# EAGLE design WiFiMp3 (EAGLE 5.10)

## Sheet 1 of 11
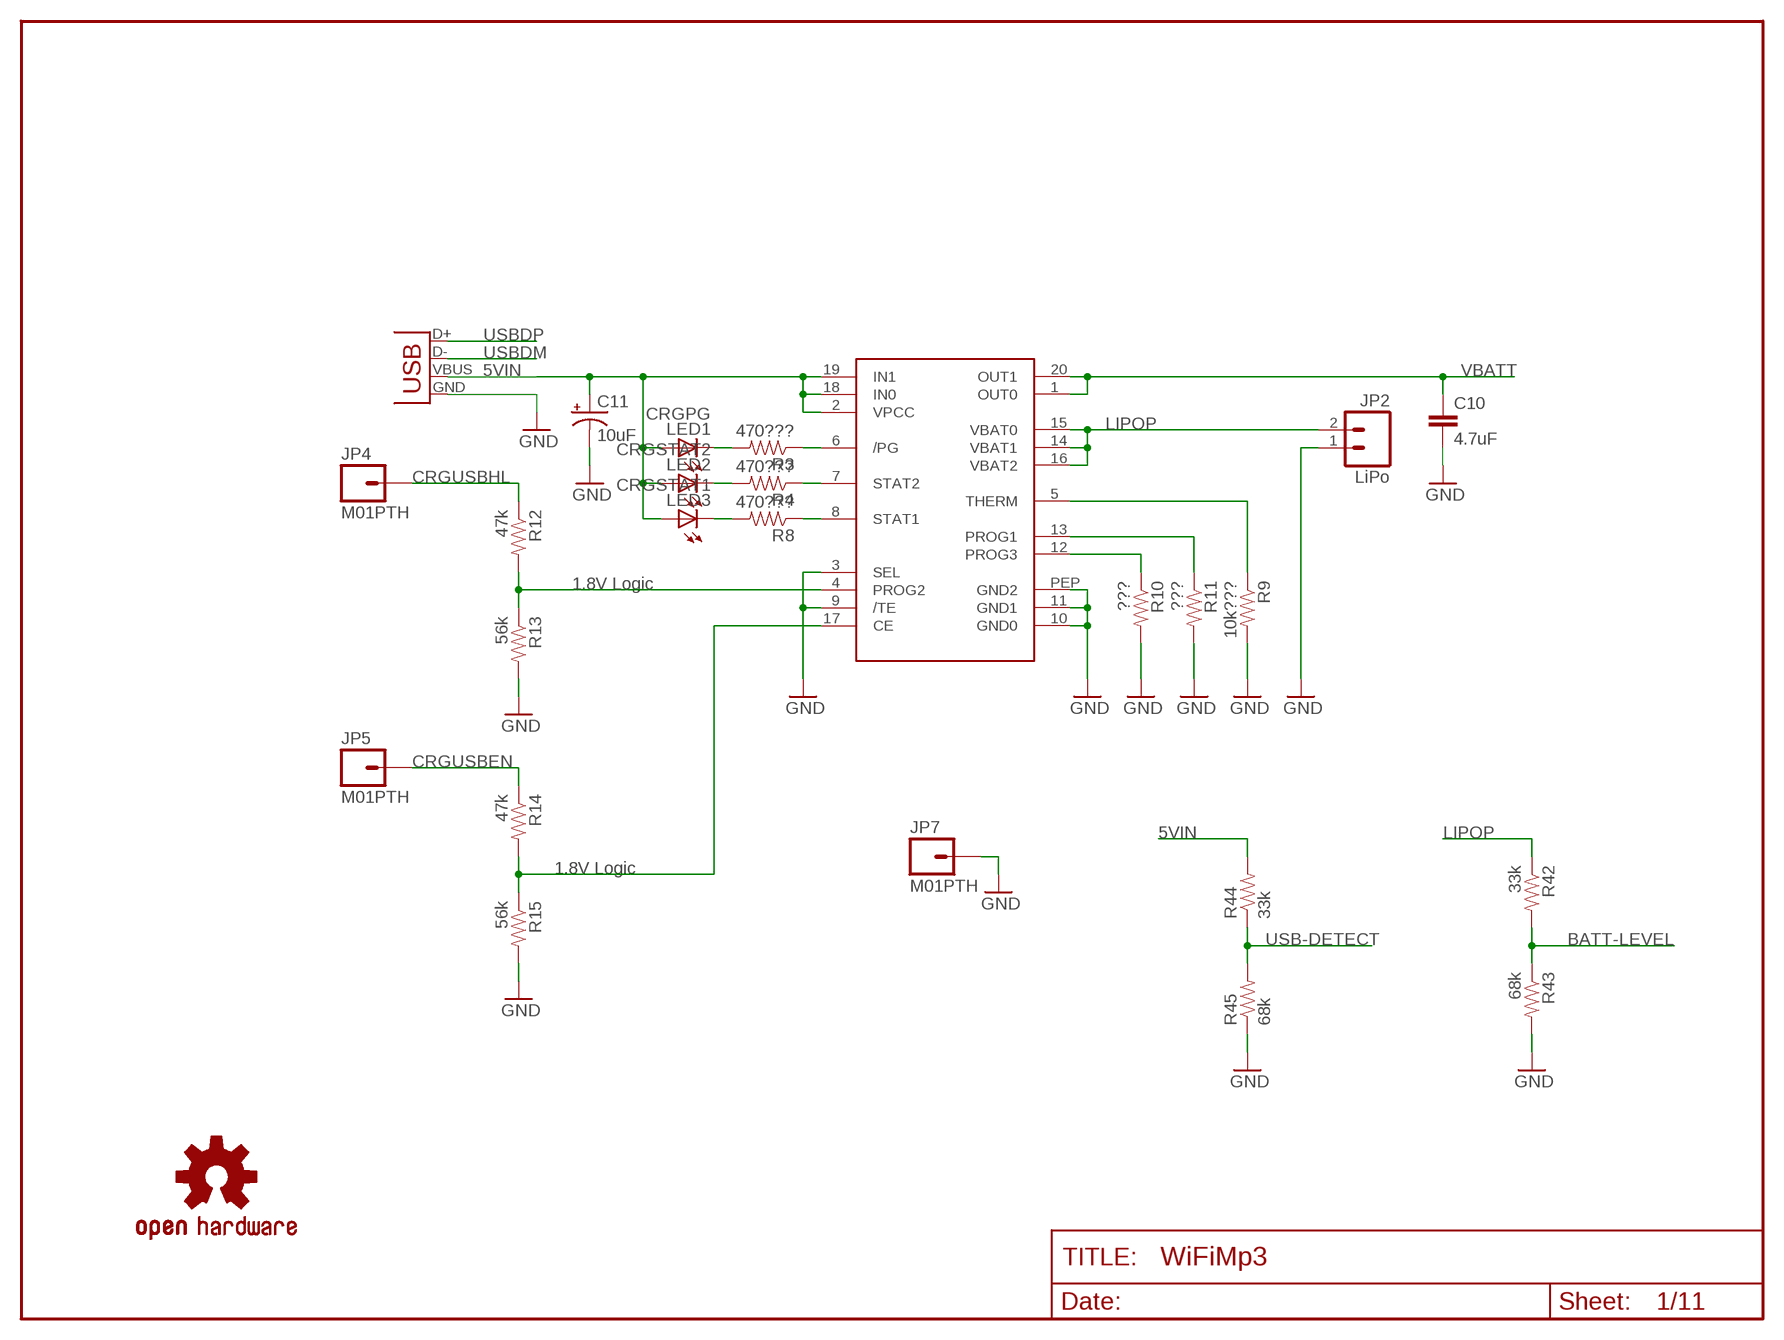
[diagram p0: schematic, sheet 1]

### Parts
C10  4.7uF  CAP0805  [0805]
C11  10uF  CAP_POL1206  [EIA3216]
JP2  LiPo  M02-JST-2MM-SMT  [JST-2-SMD]
JP4  M01PTH  [1X01]
JP5  M01PTH  [1X01]
JP7  M01PTH  [1X01]
LED1  CRGPG  LED1206  [LED-1206]
LED2  CRGSTAT2  LED1206  [LED-1206]
LED3  CRGSTAT1  LED1206  [LED-1206]
R3  470???  RESISTOR0805-RES  [0805]
R4  470???  RESISTOR0805-RES  [0805]
R8  470???  RESISTOR0805-RES  [0805]
R9  10k???  RESISTOR0805-RES  [0805]
R10  ???  RESISTOR0805-RES  [0805]
R11  ???  RESISTOR0805-RES  [0805]
R12  47k  RESISTOR0805-RES  [0805]
R13  56k  RESISTOR0805-RES  [0805]
R14  47k  RESISTOR0805-RES  [0805]
R15  56k  RESISTOR0805-RES  [0805]
R42  33k  RESISTOR0805-RES  [0805]
R43  68k  RESISTOR0805-RES  [0805]
R44  33k  RESISTOR0805-RES  [0805]
R45  68k  RESISTOR0805-RES  [0805]
U1  MCP73871  [QFN-20]
U$4  OSHW-LOGOM  [OSHW-LOGO-M]
X1  USB-MICROB  [USB-MICROB]

### Nets
5VIN: C11.A(+) LED1.A LED2.A LED3.A R44.2 U1.2(VPCC) U1.18(IN0) U1.19(IN1) X1.VBUS ; also sheet 10
BATT-LEVEL: R42.2 R43.1 ; also sheet 5
CRGUSBEN: JP5.1 R14.1 ; also sheet 5
CRGUSBHL: JP4.1 R12.1 ; also sheet 5
GND: C10.2 C11.C(-) JP2.1 JP7.1 R9.2 R10.2 R11.2 R13.2 R15.2 R43.2 R45.1 U1.3(SEL) U1.9(/TE) U1.10(GND0) U1.11(GND1) U1.PEP(GND2) X1.GND ; also sheet 2,3,4,5,6,7,8,9,10,11
LIPOP: JP2.2 R42.1 U1.14(VBAT1) U1.15(VBAT0) U1.16(VBAT2)
N$10: R3.1 U1.6(/PG)
N$11: R4.1 U1.7(STAT2)
N$12: R8.1 U1.8(STAT1)
N$13: LED3.C R8.2
N$14: LED2.C R4.2
N$15: LED1.C R3.2
N$16: R9.1 U1.5(THERM)
N$17: R12.2 R13.1 U1.4(PROG2)
N$18: R10.1 U1.12(PROG3)
N$19: R11.1 U1.13(PROG1)
N$21: R14.2 R15.1 U1.17(CE)
USB-DETECT: R44.1 R45.2 ; also sheet 5
USBDM: X1.D- ; also sheet 5,10
USBDP: X1.D+ ; also sheet 5,10
VBATT: C10.1 U1.1(OUT0) U1.20(OUT1) ; also sheet 2,3,4,5

### Notes on the sheet
- 1.8V Logic
- 1.8V Logic

## Sheet 2 of 11
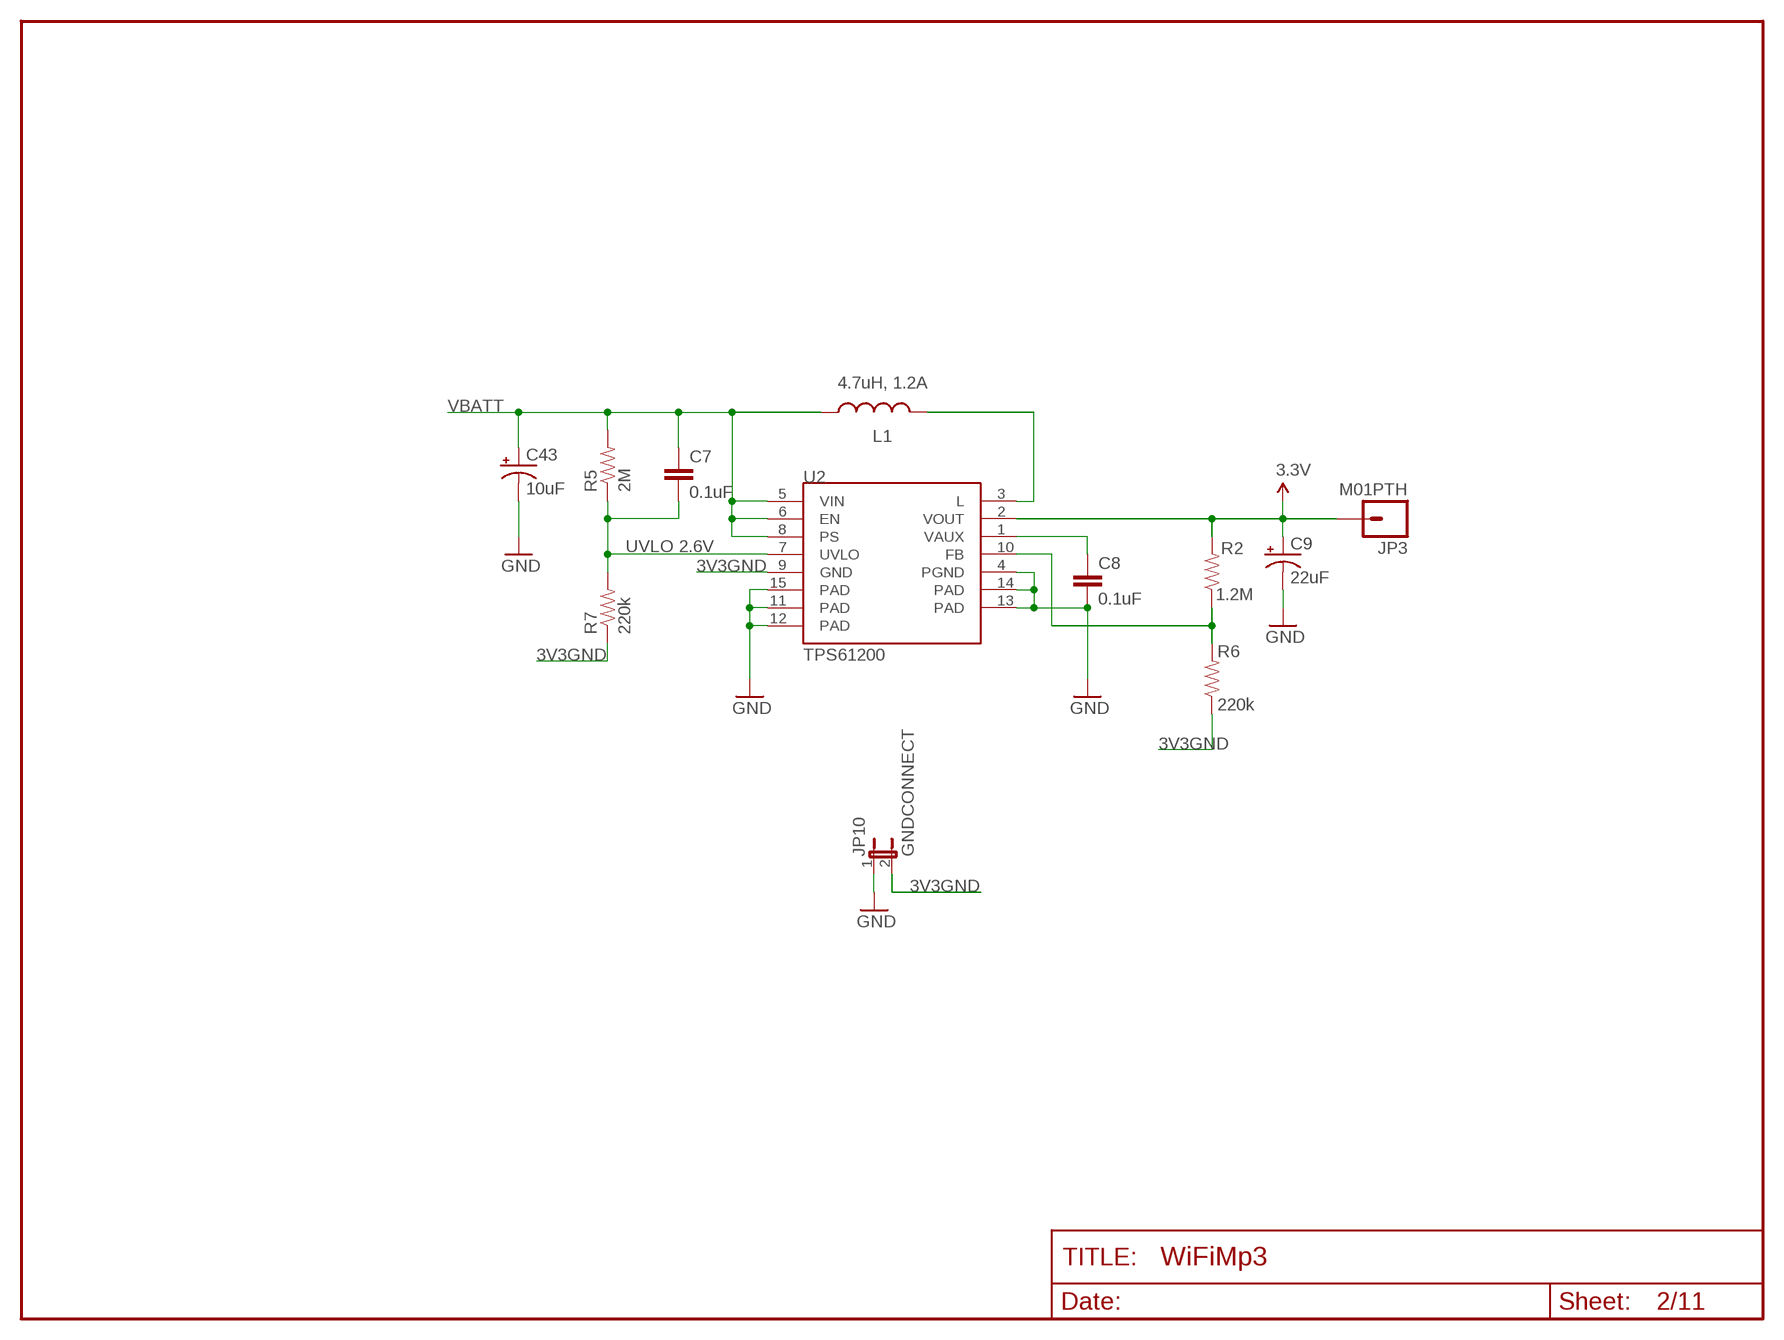
[diagram p1: schematic, sheet 2]

### Parts
C7  0.1uF  CAP0805  [0805]
C8  0.1uF  CAP0805  [0805]
C9  22uF  CAP_POL1206  [EIA3216]
C43  10uF  CAP_POL1206  [EIA3216]
JP3  M01PTH  [1X01]
JP10  GNDCONNECT  JUMPER-2SMD-NC  [SJ_2S]
L1  4.7uH, 1.2A  INDUCTOR.  [CDRH2D09]
R2  1.2M  RESISTOR0805-RES  [0805]
R5  2M  RESISTOR0805-RES  [0805]
R6  220k  RESISTOR0805-RES  [0805]
R7  220k  RESISTOR0805-RES  [0805]
U2  TPS61200  [QFN-10_PAD]

### Nets
3.3V: C9.A(+) JP3.1 R2.2 U2.2(VOUT) ; also sheet 5,6,7,8,9,10,11
3V3GND: JP10.2 R6.1 R7.1 U2.9(GND)
FB: R2.1 R6.2 U2.10(FB)
GND: C8.2 C9.C(-) C43.C(-) JP10.1 U2.4(PGND) U2.11(PAD) U2.12(PAD) U2.13(PAD) U2.14(PAD) U2.15(PAD) ; also sheet 1,3,4,5,6,7,8,9,10,11
N$6: L1.P$2 U2.3(L)
N$7: C8.1 U2.1(VAUX)
UVLO: C7.2 R5.1 R7.2 U2.7(UVLO)
VBATT: C7.1 C43.A(+) L1.P$1 R5.2 U2.5(VIN) U2.6(EN) U2.8(PS) ; also sheet 1,3,4,5

### Notes on the sheet
- UVLO 2.6V

## Sheet 3 of 11
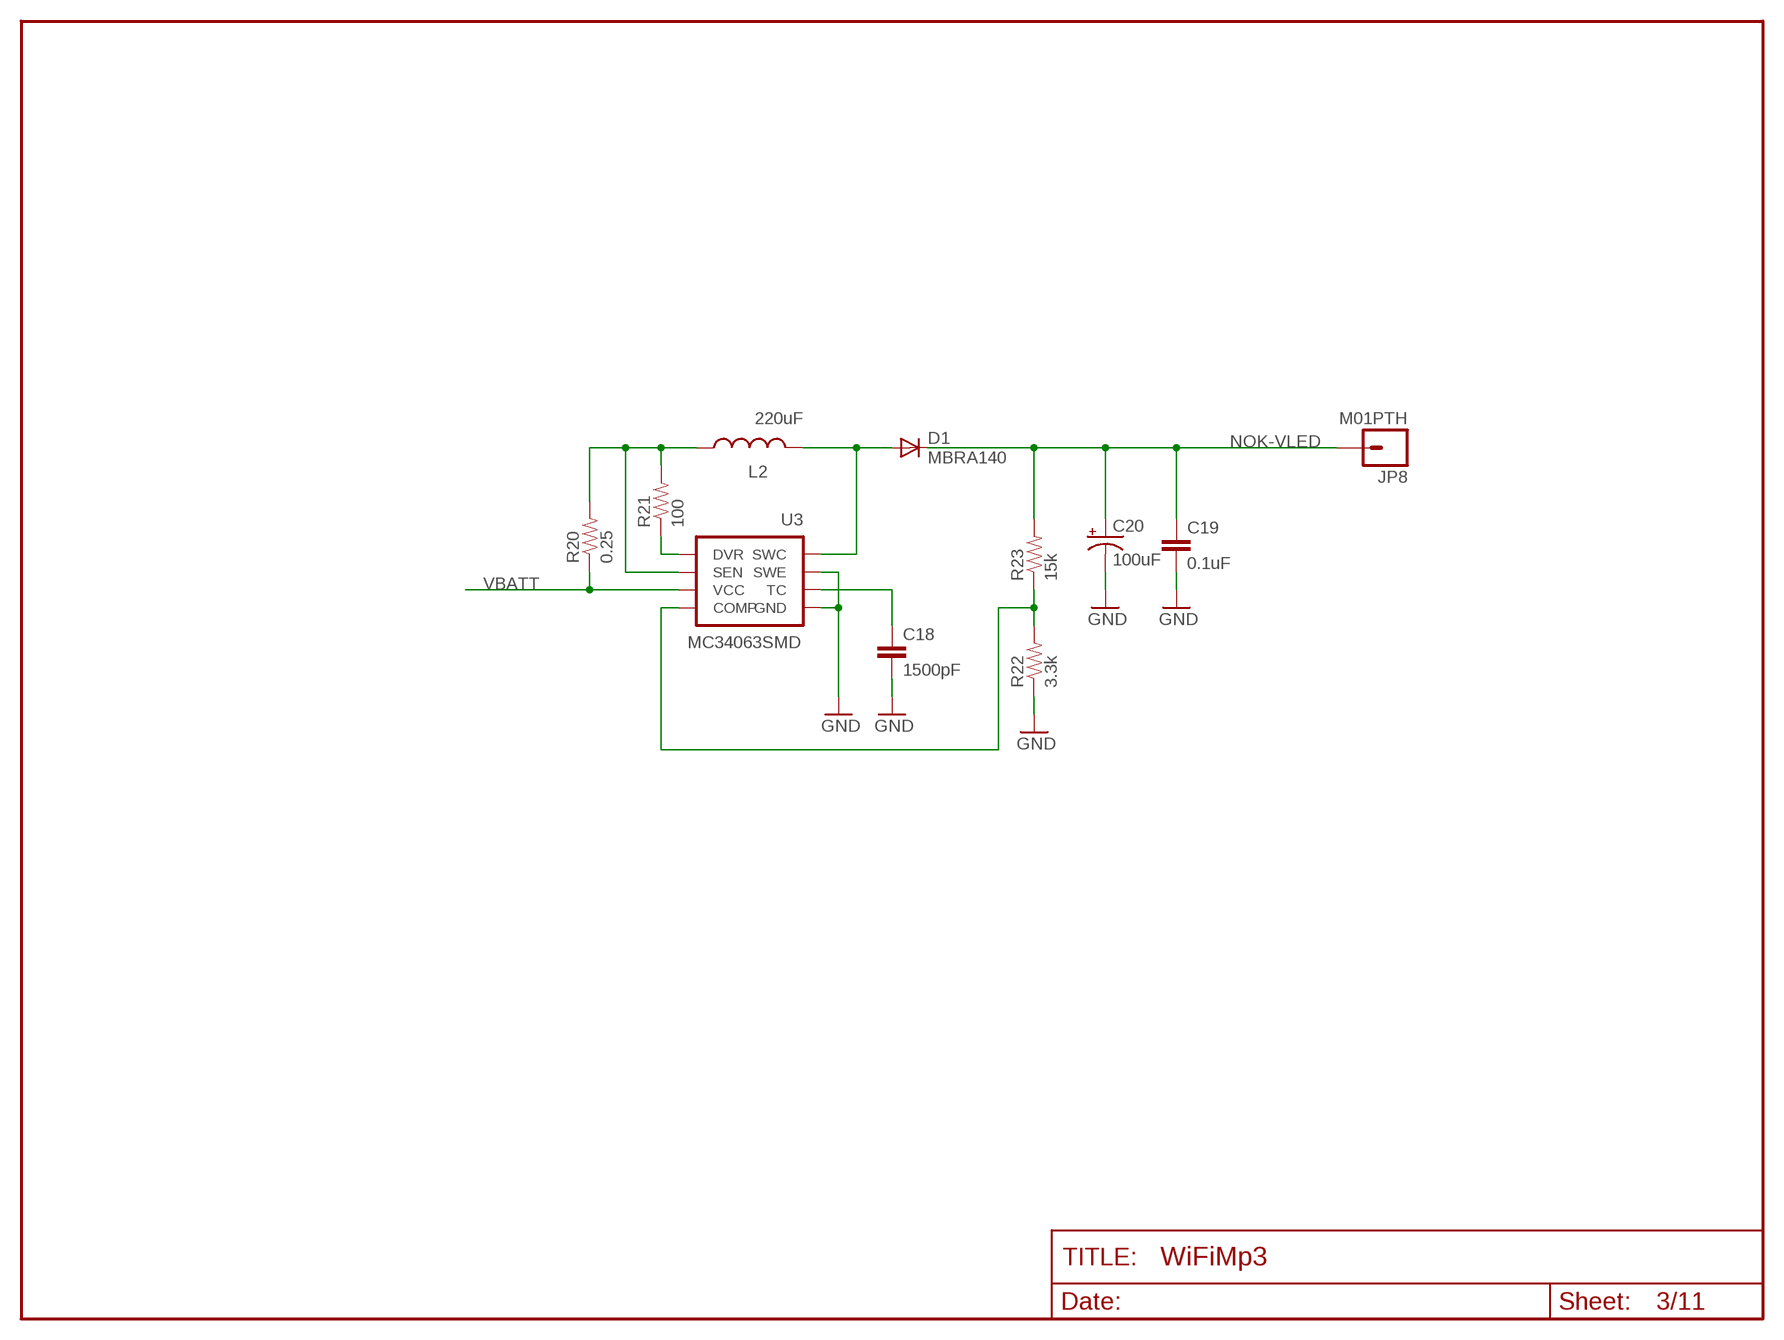
[diagram p2: schematic, sheet 3]

### Parts
C18  1500pF  CAP0805  [0805]
C19  0.1uF  CAP0805  [0805]
C20  100uF  CAP_POL1206  [EIA3216]
D1  MBRA140  DIODESOD  [SOD-323]
JP8  M01PTH  [1X01]
L2  220uF  INDUCTOR.  [CDRH2D09]
R20  0.25  RESISTOR0805-RES  [0805]
R21  100  RESISTOR0805-RES  [0805]
R22  3.3k  RESISTOR0805-RES  [0805]
R23  15k  RESISTOR0805-RES  [0805]
U3  MC34063SMD  [SO08]

### Nets
GND: C18.2 C19.2 C20.C(-) R22.1 U3.2(SWE) U3.4(GND) ; also sheet 1,2,4,5,6,7,8,9,10,11
N$26: L2.P$1 R20.2 R21.2 U3.7(SEN)
N$27: R21.1 U3.8(DVR)
N$28: R22.2 R23.1 U3.5(COMP)
N$29: C18.1 U3.3(TC)
N$30: D1.2(A) L2.P$2 U3.1(SWC)
NOK-VLED: C19.1 C20.A(+) D1.1(C) JP8.1 R23.2 ; also sheet 7
VBATT: R20.1 U3.6(VCC) ; also sheet 1,2,4,5

## Sheet 4 of 11
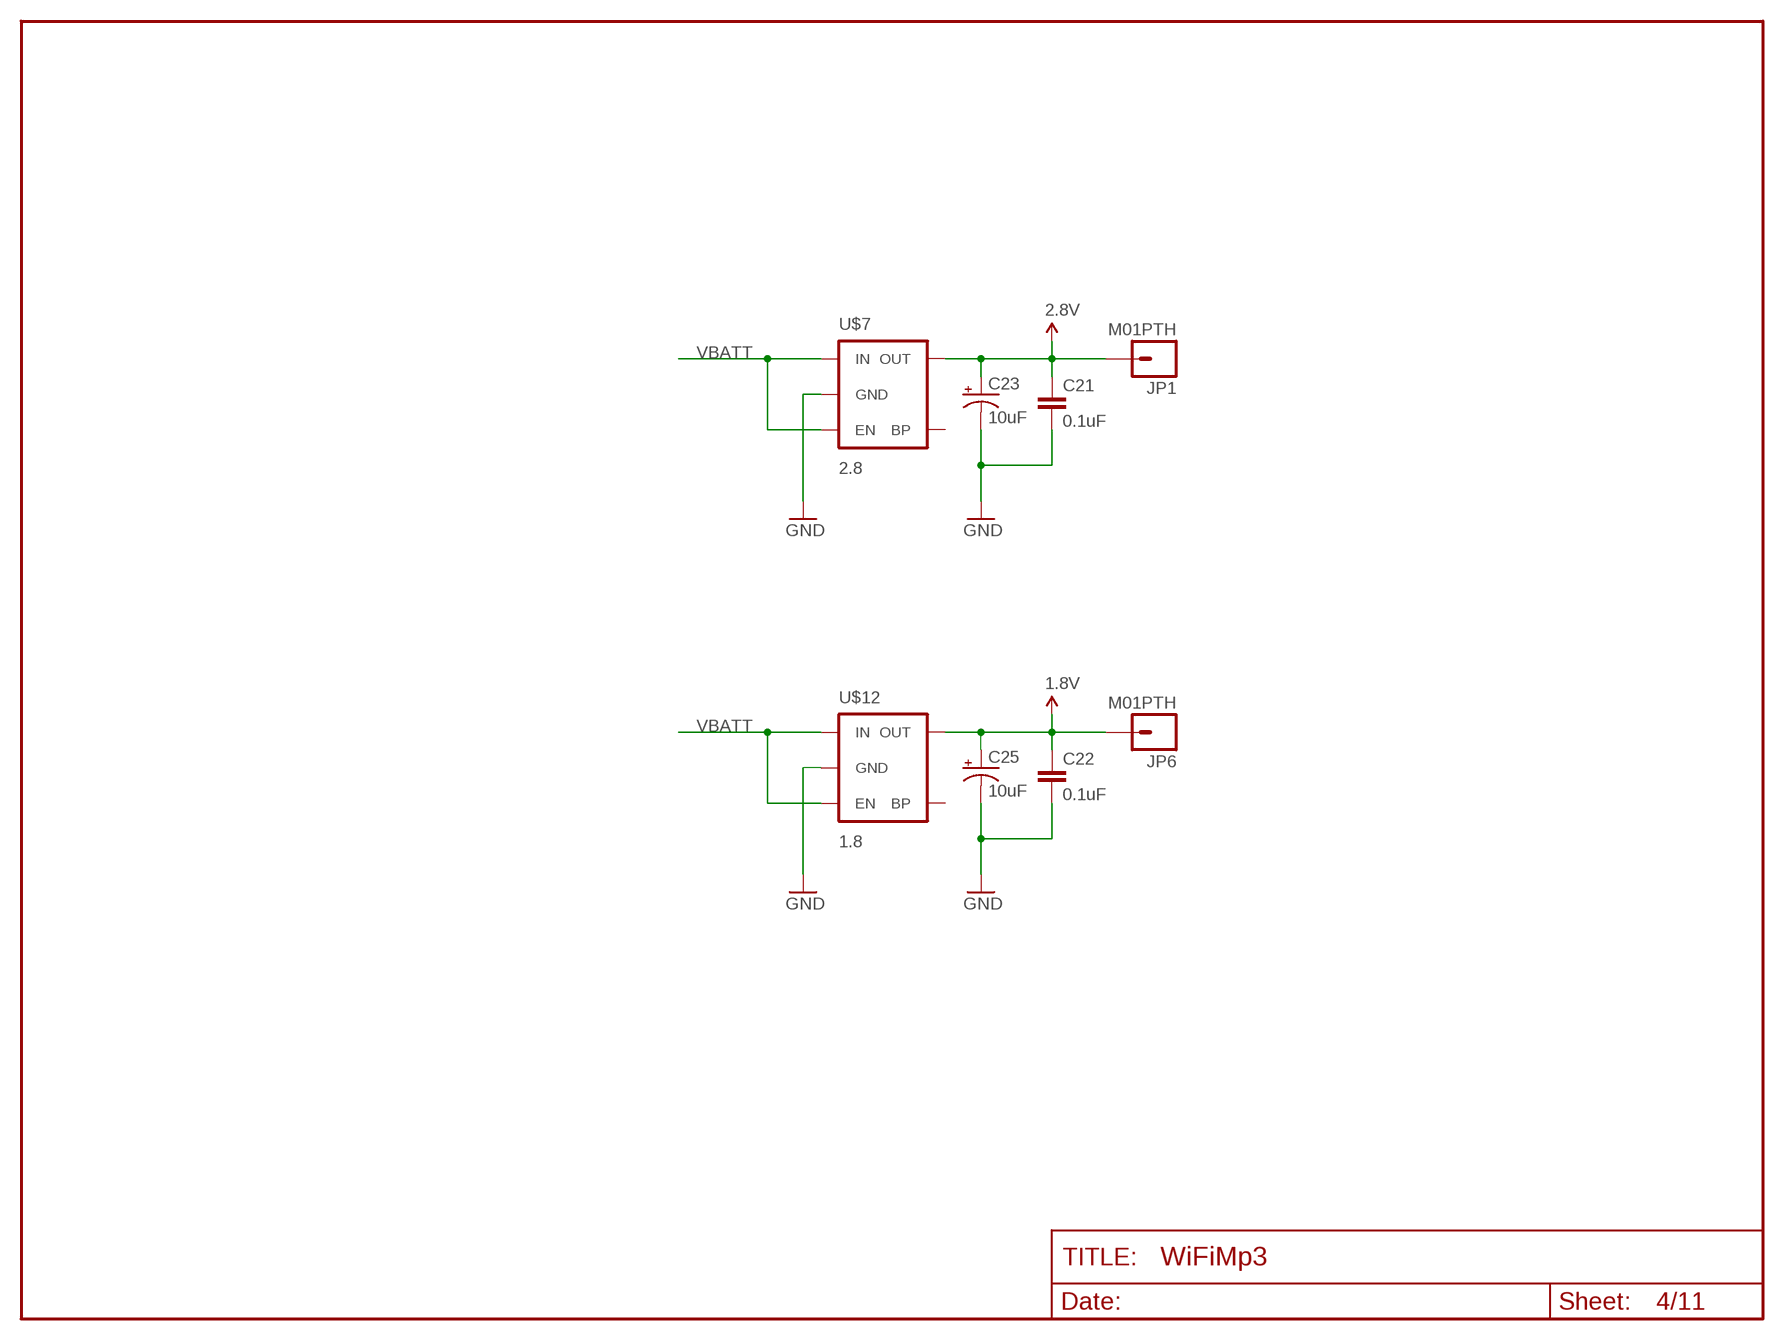
[diagram p3: schematic, sheet 4]

### Parts
C21  0.1uF  CAP0805  [0805]
C22  0.1uF  CAP0805  [0805]
C23  10uF  CAP_POL1206  [EIA3216]
C25  10uF  CAP_POL1206  [EIA3216]
JP1  M01PTH  [1X01]
JP6  M01PTH  [1X01]
U$7  2.8  V_REG_LDOSMD2  [SC70]
U$12  1.8  V_REG_LDOSMD2  [SC70]

### Nets
1.8V: C22.1 C25.A(+) JP6.1 U$12.5(OUT) ; also sheet 6
2.8V: C21.1 C23.A(+) JP1.1 U$7.5(OUT) ; also sheet 6
GND: C21.2 C22.2 C23.C(-) C25.C(-) U$7.2(GND) U$12.2(GND) ; also sheet 1,2,3,5,6,7,8,9,10,11
VBATT: U$7.1(IN) U$7.3(EN) U$12.1(IN) U$12.3(EN) ; also sheet 1,2,3,5
Unconnected: U$7.4(BP) U$12.4(BP)

## Sheet 5 of 11
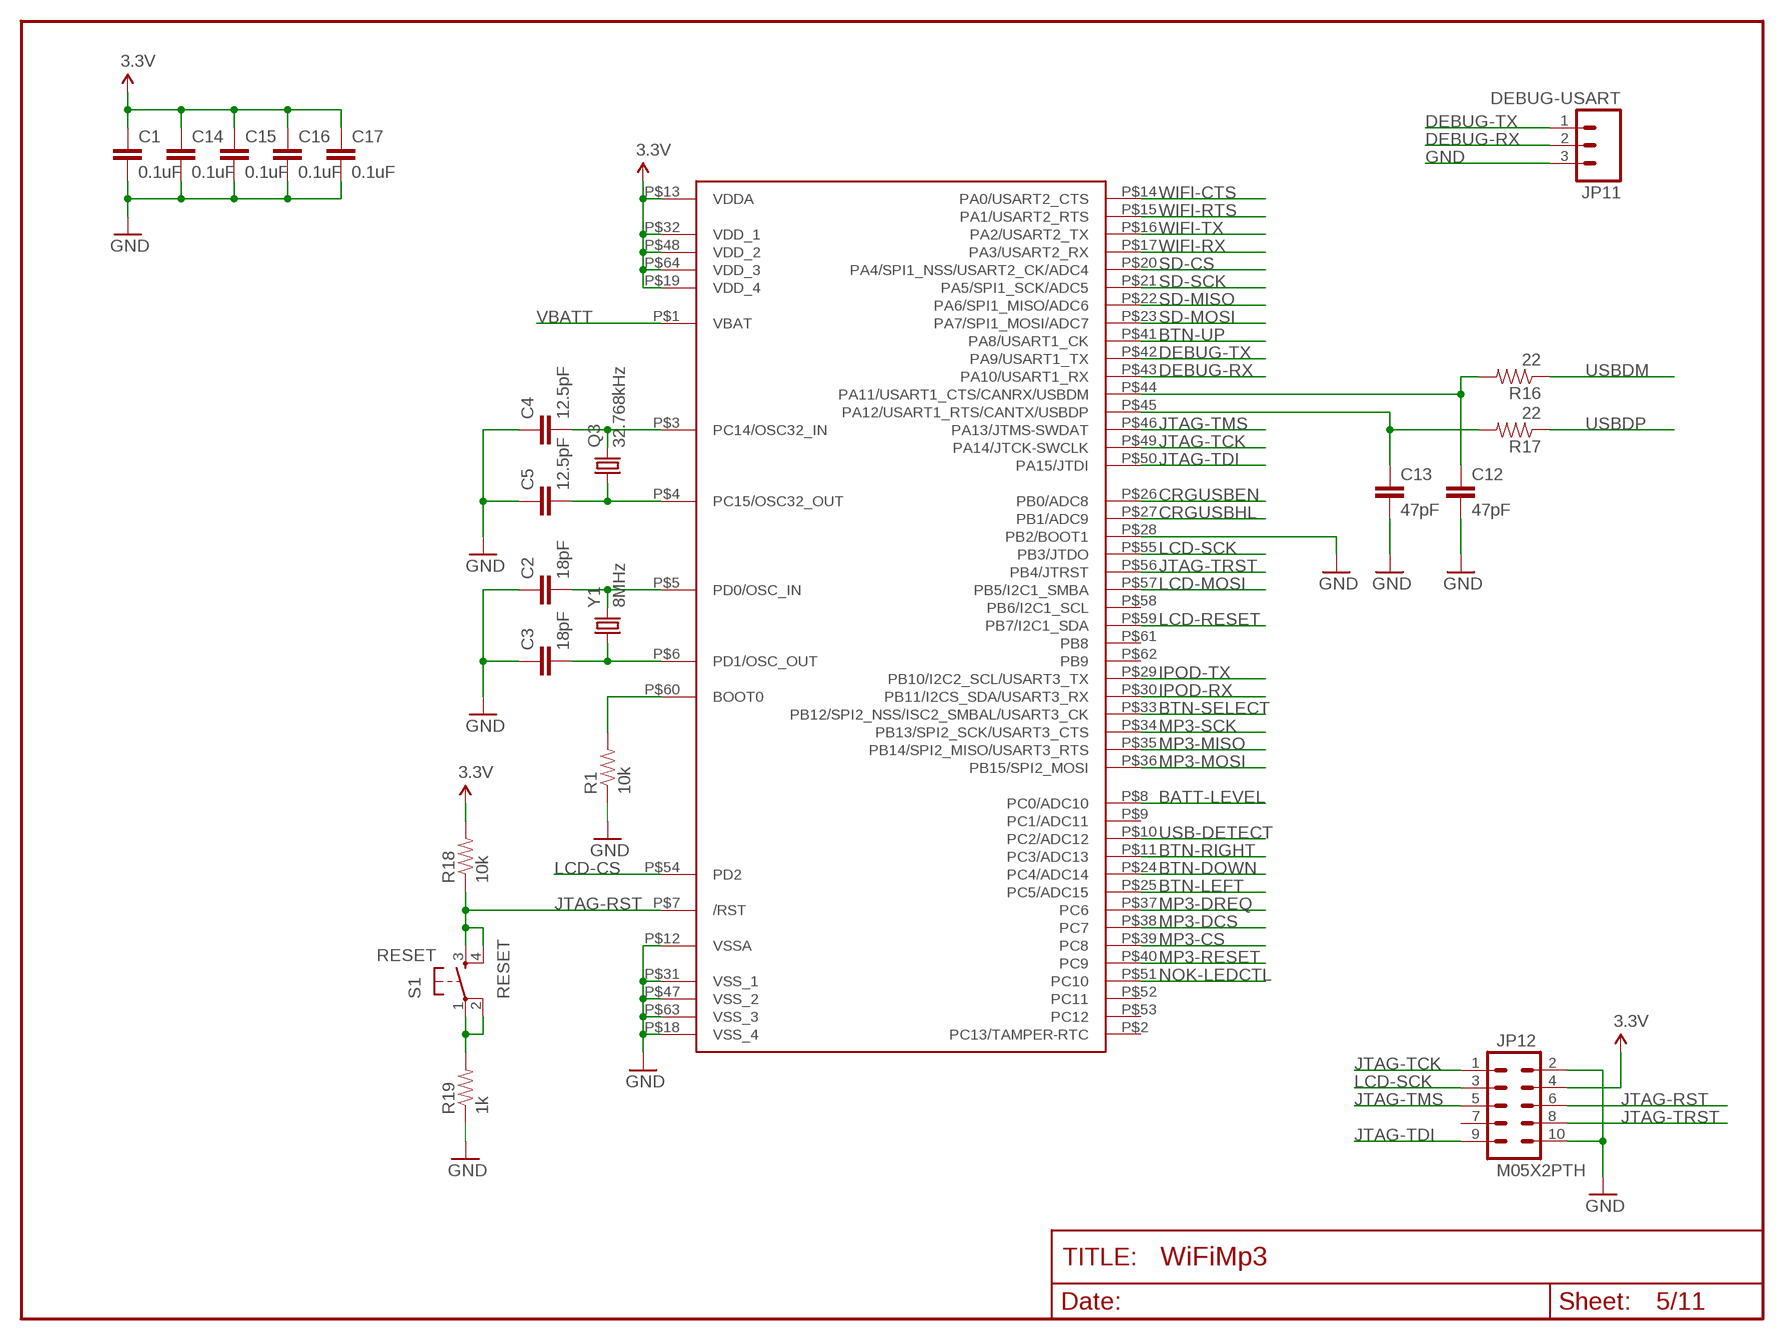
[diagram p4: schematic, sheet 5]

### Parts
C1  0.1uF  CAP0805  [0805]
C2  18pF  CAP0805  [0805]
C3  18pF  CAP0805  [0805]
C4  12.5pF  CAP0805  [0805]
C5  12.5pF  CAP0805  [0805]
C12  47pF  CAP0805  [0805]
C13  47pF  CAP0805  [0805]
C14  0.1uF  CAP0805  [0805]
C15  0.1uF  CAP0805  [0805]
C16  0.1uF  CAP0805  [0805]
C17  0.1uF  CAP0805  [0805]
JP11  DEBUG-USART  M03PTH  [1X03]
JP12  M05X2PTH  [AVR_ICSP]
Q3  32.768kHz  CRYSTALSOJ-4-5.5MM  [SOJ-4-5.5MM]
R1  10k  RESISTOR0805-RES  [0805]
R16  22  RESISTOR0805-RES  [0805]
R17  22  RESISTOR0805-RES  [0805]
R18  10k  RESISTOR0805-RES  [0805]
R19  1k  RESISTOR0805-RES  [0805]
S1  RESET  TAC_SWITCHSMD  [TACTILE_SWITCH_SMD]
U$2  STM32F103  [TQFP-10X10-64]
Y1  8MHz  CRYSTAL5X3  [CRYSTAL-SMD-5X3]

### Nets
3.3V: C1.1 C14.1 C15.1 C16.1 C17.1 JP12.4 R18.2 U$2.P$13(VDDA) U$2.P$19(VDD_4) U$2.P$32(VDD_1) U$2.P$48(VDD_2) U$2.P$64(VDD_3) ; also sheet 2,6,7,8,9,10,11
BATT-LEVEL: U$2.P$8(PC0/ADC10) ; also sheet 1
BTN-DOWN: U$2.P$24(PC4/ADC14) ; also sheet 11
BTN-LEFT: U$2.P$25(PC5/ADC15) ; also sheet 11
BTN-RIGHT: U$2.P$11(PC3/ADC13) ; also sheet 11
BTN-SELECT: U$2.P$33(PB12/SPI2_NSS/ISC2_SMBAL/USART3_CK) ; also sheet 11
BTN-UP: U$2.P$41(PA8/USART1_CK) ; also sheet 11
CRGUSBEN: U$2.P$26(PB0/ADC8) ; also sheet 1
CRGUSBHL: U$2.P$27(PB1/ADC9) ; also sheet 1
DEBUG-RX: JP11.2 U$2.P$43(PA10/USART1_RX)
DEBUG-TX: JP11.1 U$2.P$42(PA9/USART1_TX)
GND: C1.2 C2.1 C3.1 C4.1 C5.1 C12.2 C13.2 C14.2 C15.2 C16.2 C17.2 JP11.3 JP12.2 JP12.10 R1.1 R19.1 U$2.P$12(VSSA) U$2.P$18(VSS_4) U$2.P$28(PB2/BOOT1) U$2.P$31(VSS_1) U$2.P$47(VSS_2) U$2.P$63(VSS_3) ; also sheet 1,2,3,4,6,7,8,9,10,11
IPOD-RX: U$2.P$30(PB11/I2CS_SDA/USART3_RX) ; also sheet 10
IPOD-TX: U$2.P$29(PB10/I2C2_SCL/USART3_TX) ; also sheet 10
JTAG-RST: JP12.6 R18.1 S1.3 S1.4 U$2.P$7(/RST)
JTAG-TCK: JP12.1 U$2.P$49(PA14/JTCK-SWCLK)
JTAG-TDI: JP12.9 U$2.P$50(PA15/JTDI)
JTAG-TMS: JP12.5 U$2.P$46(PA13/JTMS-SWDAT)
JTAG-TRST: JP12.8 U$2.P$56(PB4/JTRST)
LCD-CS: U$2.P$54(PD2) ; also sheet 7
LCD-MOSI: U$2.P$57(PB5/I2C1_SMBA) ; also sheet 7
LCD-RESET: U$2.P$59(PB7/I2C1_SDA) ; also sheet 7
LCD-SCK: JP12.3 U$2.P$55(PB3/JTDO) ; also sheet 7
MP3-CS: U$2.P$39(PC8) ; also sheet 6
MP3-DCS: U$2.P$38(PC7) ; also sheet 6
MP3-DREQ: U$2.P$37(PC6) ; also sheet 6
MP3-MISO: U$2.P$35(PB14/SPI2_MISO/USART3_RTS) ; also sheet 6
MP3-MOSI: U$2.P$36(PB15/SPI2_MOSI) ; also sheet 6
MP3-RESET: U$2.P$40(PC9) ; also sheet 6
MP3-SCK: U$2.P$34(PB13/SPI2_SCK/USART3_CTS) ; also sheet 6
N$1: R1.2 U$2.P$60(BOOT0)
N$2: C4.2 Q3.P4 U$2.P$3(PC14/OSC32_IN)
N$3: C3.2 U$2.P$6(PD1/OSC_OUT) Y1.1
N$4: C2.2 U$2.P$5(PD0/OSC_IN) Y1.3
N$5: C5.2 Q3.P1 U$2.P$4(PC15/OSC32_OUT)
N$20: C13.1 R17.2 U$2.P$45(PA12/USART1_RTS/CANTX/USBDP)
N$22: C12.1 R16.2 U$2.P$44(PA11/USART1_CTS/CANRX/USBDM)
N$25: R19.2 S1.1 S1.2
NOK-LEDCTL: U$2.P$51(PC10) ; also sheet 7
SD-CS: U$2.P$20(PA4/SPI1_NSS/USART2_CK/ADC4) ; also sheet 8
SD-MISO: U$2.P$22(PA6/SPI1_MISO/ADC6) ; also sheet 8
SD-MOSI: U$2.P$23(PA7/SPI1_MOSI/ADC7) ; also sheet 8
SD-SCK: U$2.P$21(PA5/SPI1_SCK/ADC5) ; also sheet 8
USB-DETECT: U$2.P$10(PC2/ADC12) ; also sheet 1
USBDM: R16.1 ; also sheet 1,10
USBDP: R17.1 ; also sheet 1,10
VBATT: U$2.P$1(VBAT) ; also sheet 1,2,3,4
WIFI-CTS: U$2.P$14(PA0/USART2_CTS) ; also sheet 9
WIFI-RTS: U$2.P$15(PA1/USART2_RTS) ; also sheet 9
WIFI-RX: U$2.P$17(PA3/USART2_RX) ; also sheet 9
WIFI-TX: U$2.P$16(PA2/USART2_TX) ; also sheet 9
Unconnected: JP12.7 U$2.P$2(PC13/TAMPER-RTC) U$2.P$9(PC1/ADC11) U$2.P$52(PC11) U$2.P$53(PC12) U$2.P$58(PB6/I2C1_SCL) U$2.P$61(PB8) U$2.P$62(PB9)

### Notes on the sheet
- RESET

## Sheet 6 of 11
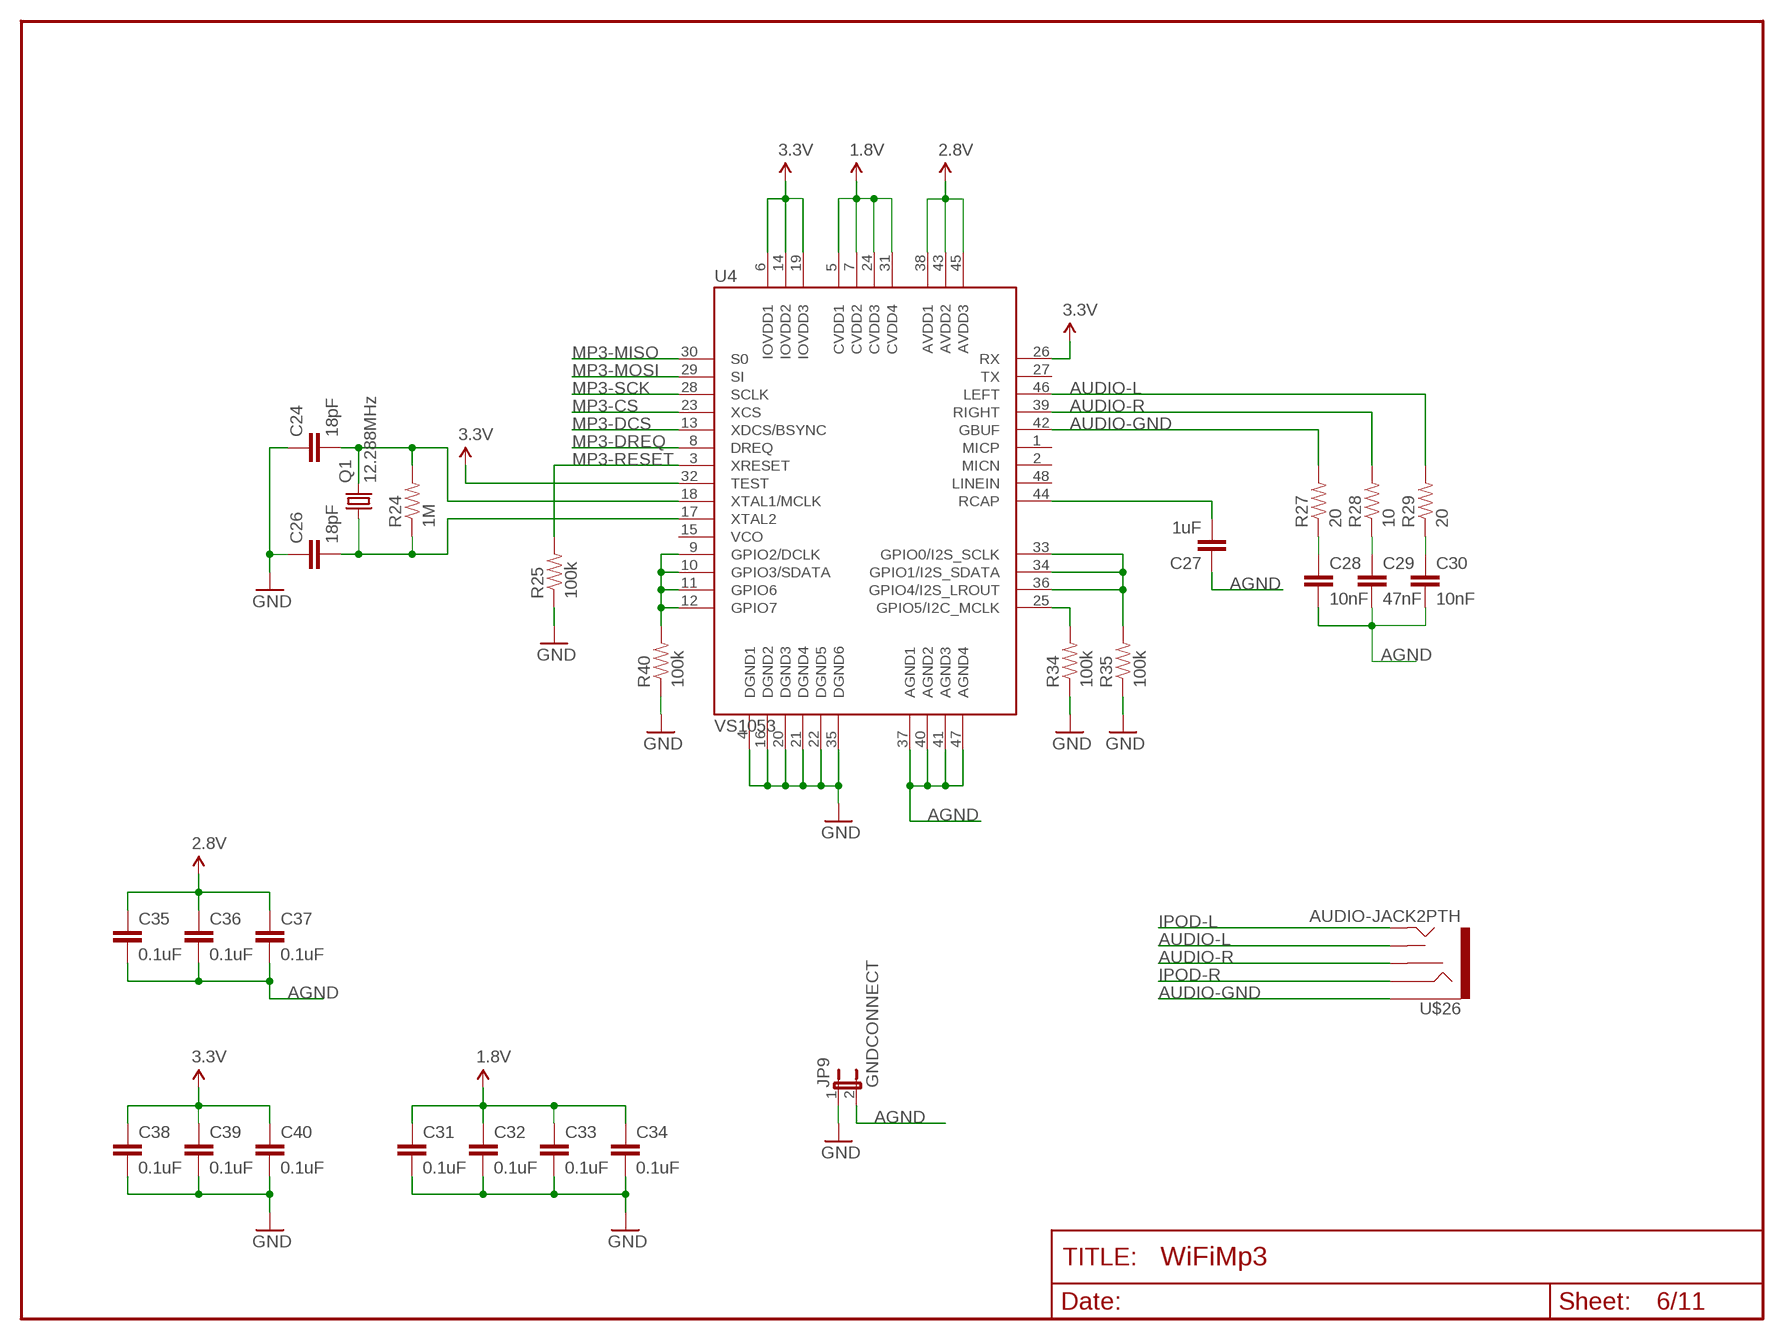
[diagram p5: schematic, sheet 6]

### Parts
C24  18pF  CAP0805  [0805]
C26  18pF  CAP0805  [0805]
C27  1uF  CAP0805  [0805]
C28  10nF  CAP0805  [0805]
C29  47nF  CAP0805  [0805]
C30  10nF  CAP0805  [0805]
C31  0.1uF  CAP0805  [0805]
C32  0.1uF  CAP0805  [0805]
C33  0.1uF  CAP0805  [0805]
C34  0.1uF  CAP0805  [0805]
C35  0.1uF  CAP0805  [0805]
C36  0.1uF  CAP0805  [0805]
C37  0.1uF  CAP0805  [0805]
C38  0.1uF  CAP0805  [0805]
C39  0.1uF  CAP0805  [0805]
C40  0.1uF  CAP0805  [0805]
JP9  GNDCONNECT  JUMPER-2SMD-NC  [SJ_2S]
Q1  12.288MHz  CRYSTALSMD  [HC49UP]
R24  1M  RESISTOR0805-RES  [0805]
R25  100k  RESISTOR0805-RES  [0805]
R27  20  RESISTOR0805-RES  [0805]
R28  10  RESISTOR0805-RES  [0805]
R29  20  RESISTOR0805-RES  [0805]
R34  100k  RESISTOR0805-RES  [0805]
R35  100k  RESISTOR0805-RES  [0805]
R40  100k  RESISTOR0805-RES  [0805]
U4  VS1053  VS1033  [LQFP-48]
U$26  AUDIO-JACK2PTH  [AUDIO-JACK]

### Nets
1.8V: C31.1 C32.1 C33.1 C34.1 U4.5(CVDD1) U4.7(CVDD2) U4.24(CVDD3) U4.31(CVDD4) ; also sheet 4
2.8V: C35.1 C36.1 C37.1 U4.38(AVDD1) U4.43(AVDD2) U4.45(AVDD3) ; also sheet 4
3.3V: C38.1 C39.1 C40.1 U4.6(IOVDD1) U4.14(IOVDD2) U4.19(IOVDD3) U4.26(RX) U4.32(TEST) ; also sheet 2,5,7,8,9,10,11
AGND: C27.1 C28.2 C29.2 C30.2 C35.2 C36.2 C37.2 JP9.2 U4.37(AGND1) U4.40(AGND2) U4.41(AGND3) U4.47(AGND4)
AUDIO-GND: R27.2 U4.42(GBUF) U$26.SLEEVE
AUDIO-L: R29.2 U4.46(LEFT) U$26.TSH
AUDIO-R: R28.2 U4.39(RIGHT) U$26.RSH
GND: C24.1 C26.1 C31.2 C32.2 C33.2 C34.2 C38.2 C39.2 C40.2 JP9.1 R25.1 R34.1 R35.1 R40.1 U4.4(DGND1) U4.16(DGND2) U4.20(DGND3) U4.21(DGND4) U4.22(DGND5) U4.35(DGND6) ; also sheet 1,2,3,4,5,7,8,9,10,11
IPOD-L: U$26.TIP ; also sheet 10
IPOD-R: U$26.RING ; also sheet 10
MP3-CS: U4.23(XCS) ; also sheet 5
MP3-DCS: U4.13(XDCS/BSYNC) ; also sheet 5
MP3-DREQ: U4.8(DREQ) ; also sheet 5
MP3-MISO: U4.30(S0) ; also sheet 5
MP3-MOSI: U4.29(SI) ; also sheet 5
MP3-RESET: R25.2 U4.3(XRESET) ; also sheet 5
MP3-SCK: U4.28(SCLK) ; also sheet 5
MP3GPIOGND1: R40.2 U4.9(GPIO2/DCLK) U4.10(GPIO3/SDATA) U4.11(GPIO6) U4.12(GPIO7)
MP3GPIOGND2: R35.2 U4.33(GPIO0/I2S_SCLK) U4.34(GPIO1/I2S_SDATA) U4.36(GPIO4/I2S_LROUT)
MP3GPIOGND3: R34.2 U4.25(GPIO5/I2C_MCLK)
N$8: C24.2 Q1.2 R24.2 U4.18(XTAL1/MCLK)
N$23: C26.2 Q1.1 R24.1 U4.17(XTAL2)
N$24: C27.2 U4.44(RCAP)
N$31: C30.1 R29.1
N$32: C29.1 R28.1
N$33: C28.1 R27.1
Unconnected: U4.1(MICP) U4.2(MICN) U4.15(VCO) U4.27(TX) U4.48(LINEIN)

## Sheet 7 of 11
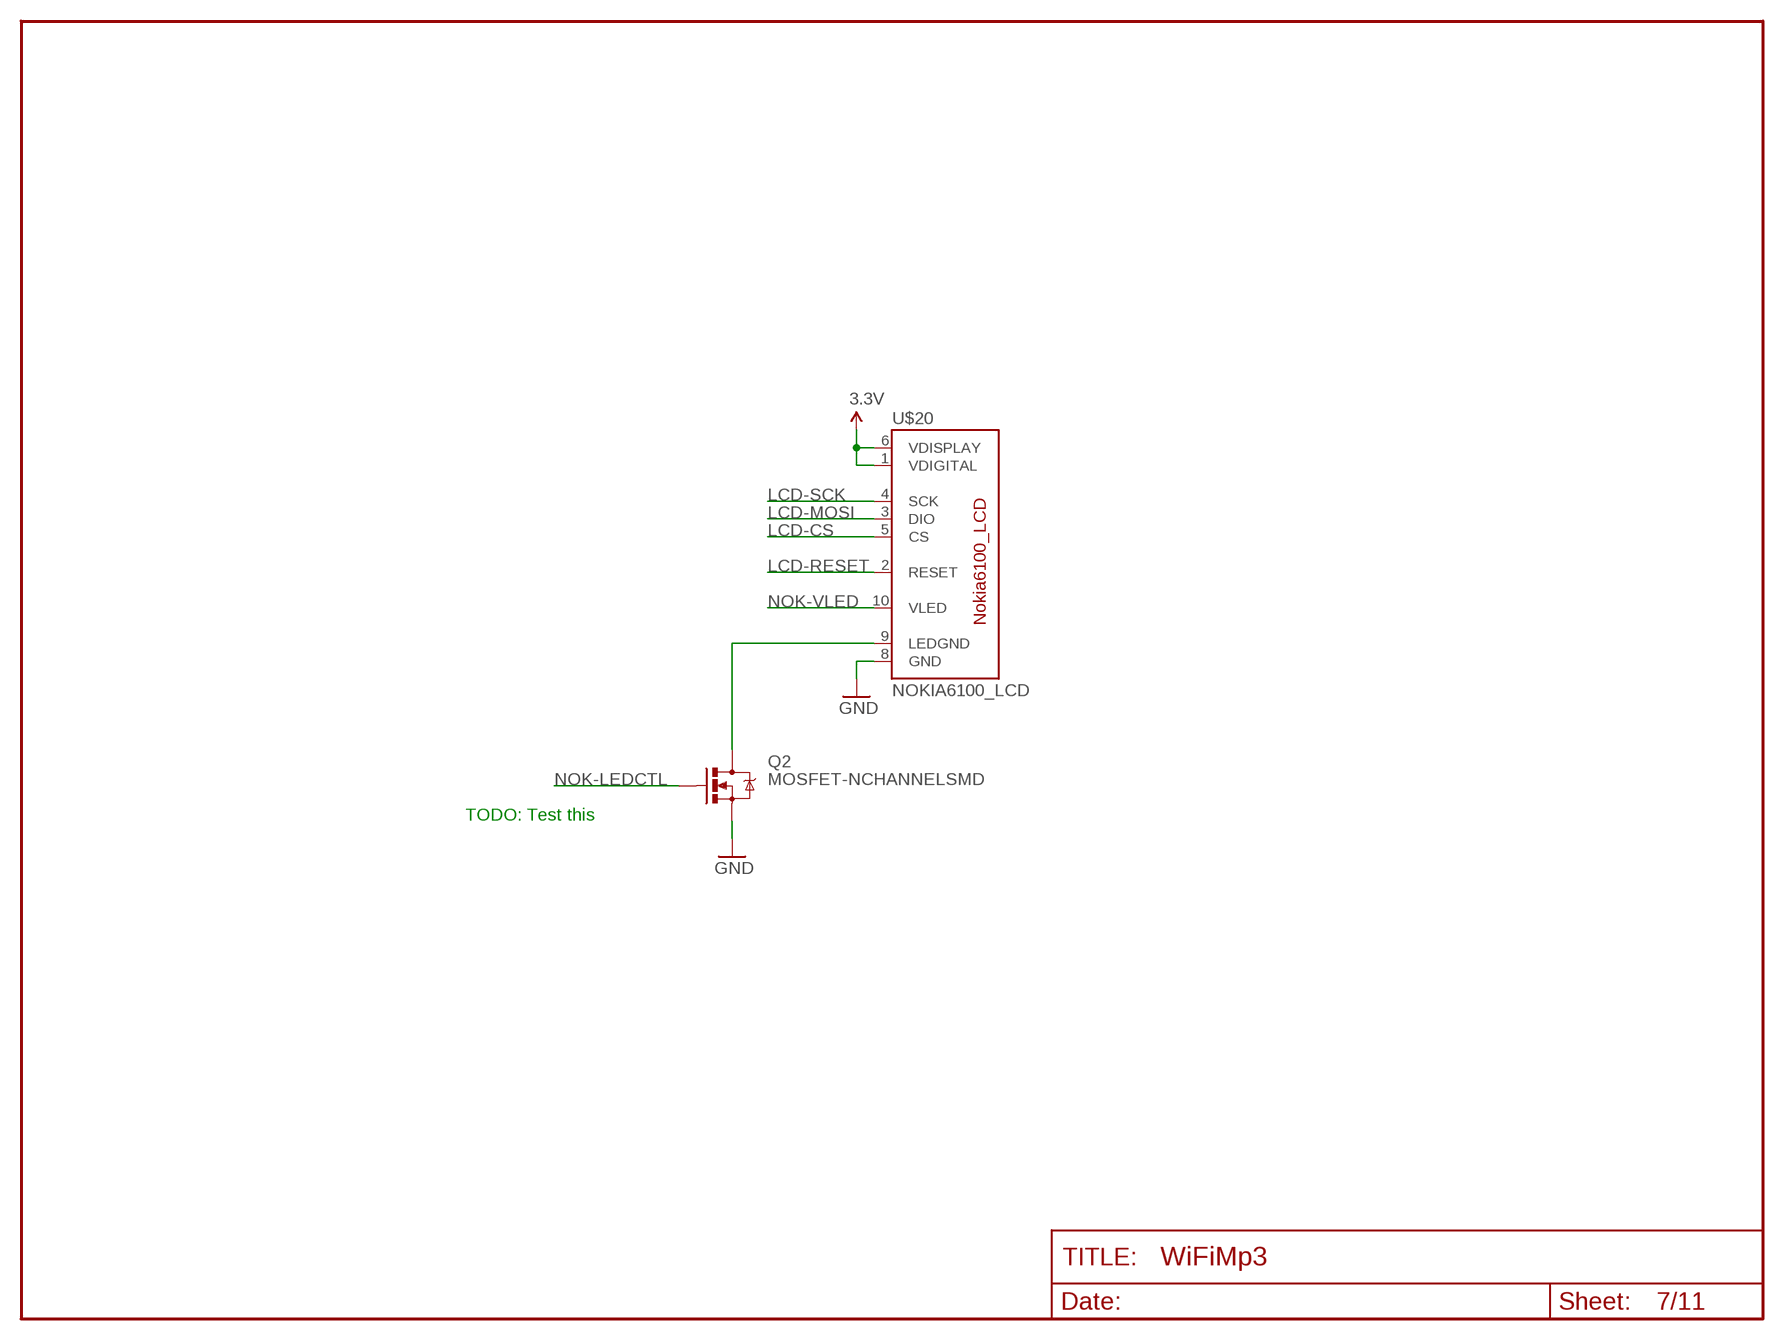
[diagram p6: schematic, sheet 7]

### Parts
Q2  MOSFET-NCHANNELSMD  [SOT23-3]
U$20  NOKIA6100_LCD  [NOKIA6100_LCD]

### Nets
3.3V: U$20.1(VDIGITAL) U$20.6(VDISPLAY) ; also sheet 2,5,6,8,9,10,11
GND: Q2.2(S) U$20.8(GND) ; also sheet 1,2,3,4,5,6,8,9,10,11
LCD-CS: U$20.5(CS) ; also sheet 5
LCD-MOSI: U$20.3(DIO) ; also sheet 5
LCD-RESET: U$20.2(RESET) ; also sheet 5
LCD-SCK: U$20.4(SCK) ; also sheet 5
N$9: Q2.3(D) U$20.9(LEDGND)
NOK-LEDCTL: Q2.1(G) ; also sheet 5
NOK-VLED: U$20.10(VLED) ; also sheet 3

### Notes on the sheet
- TODO: Test this

## Sheet 8 of 11
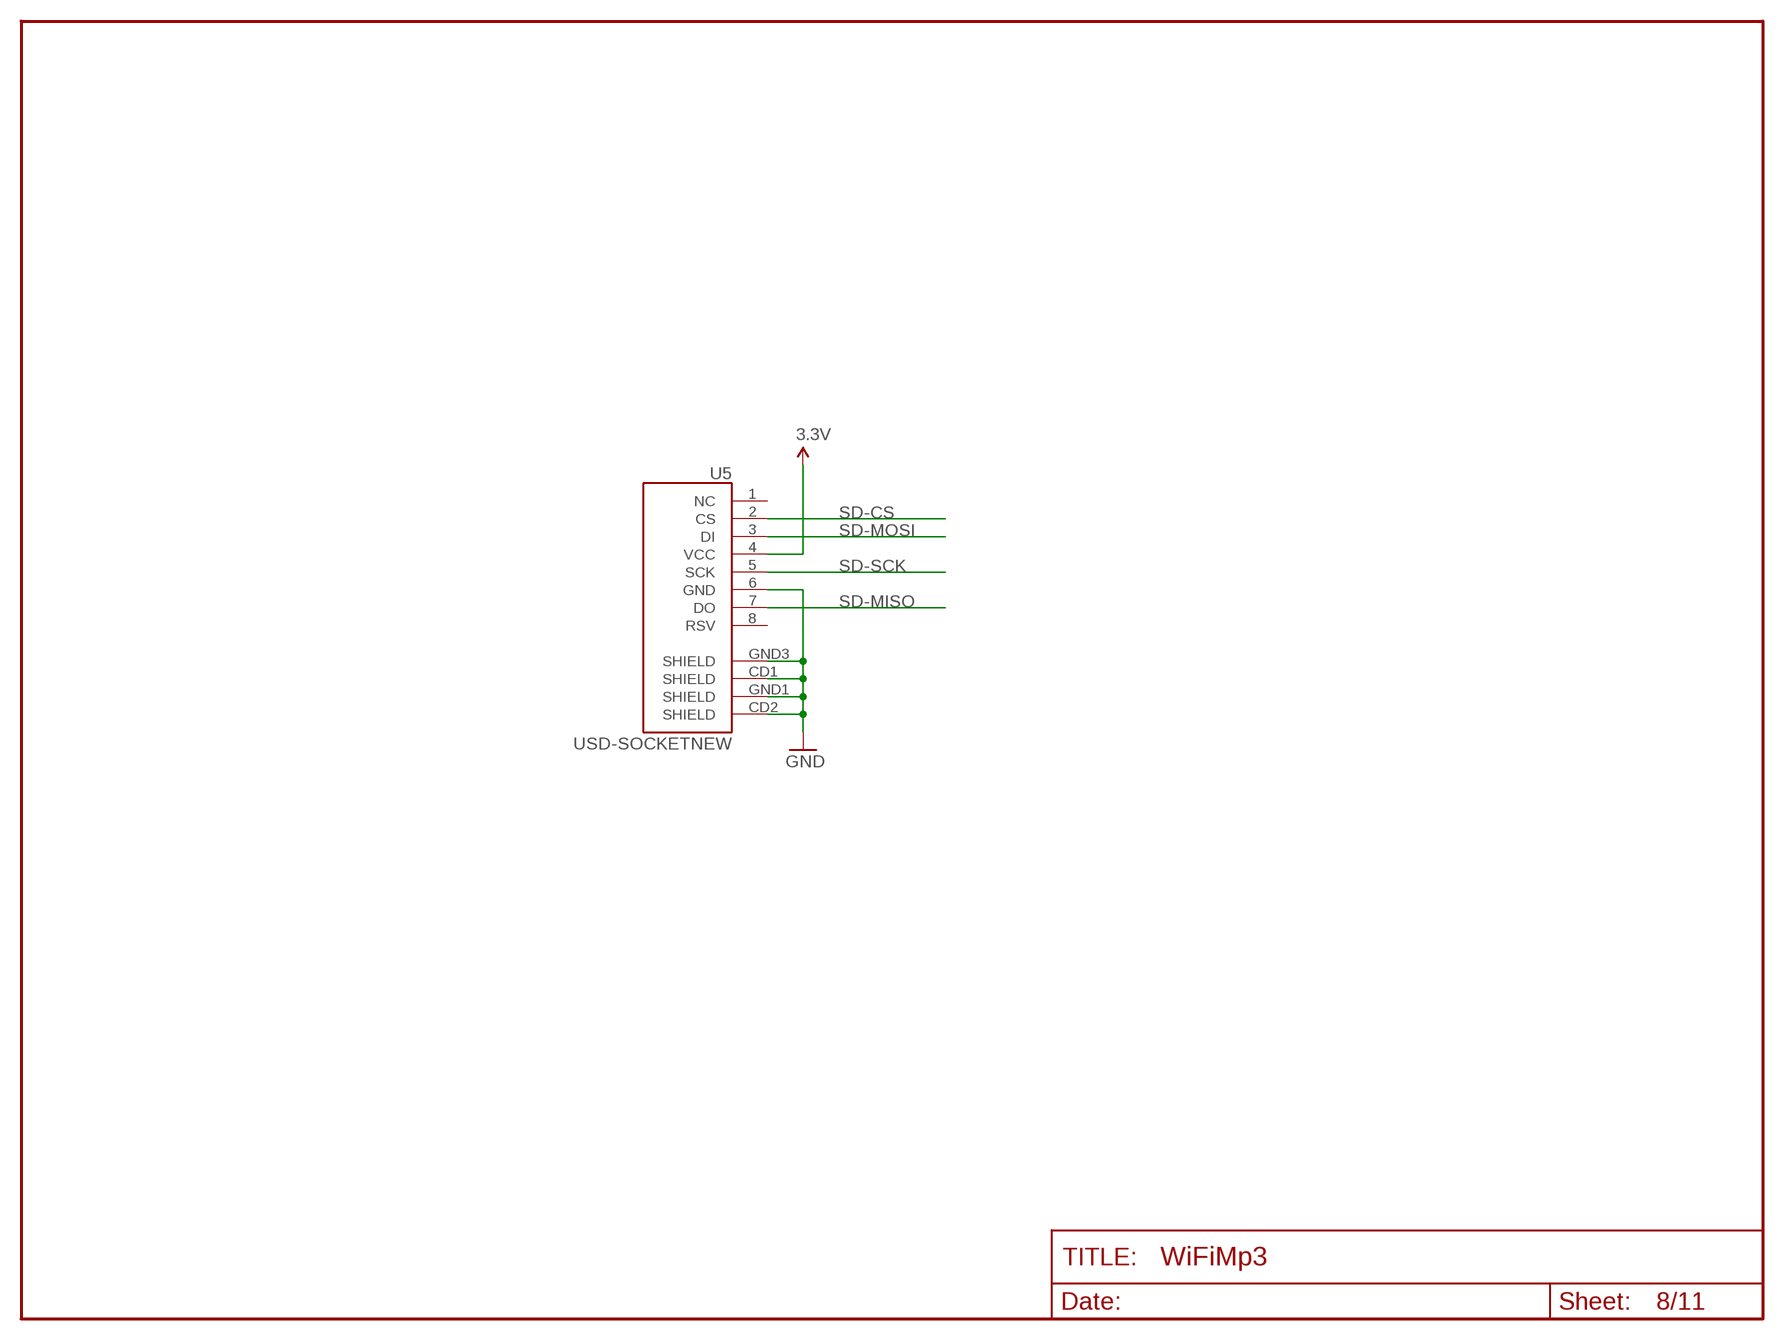
[diagram p7: schematic, sheet 8]

### Parts
U5  USD-SOCKETNEW  [MICRO-SD-SOCKET-PP]

### Nets
3.3V: U5.4(VCC) ; also sheet 2,5,6,7,9,10,11
GND: U5.6(GND) U5.CD1(SHIELD) U5.CD2(SHIELD) U5.GND1(SHIELD) U5.GND3(SHIELD) ; also sheet 1,2,3,4,5,6,7,9,10,11
SD-CS: U5.2(CS) ; also sheet 5
SD-MISO: U5.7(DO) ; also sheet 5
SD-MOSI: U5.3(DI) ; also sheet 5
SD-SCK: U5.5(SCK) ; also sheet 5
Unconnected: U5.1(NC) U5.8(RSV)

## Sheet 9 of 11
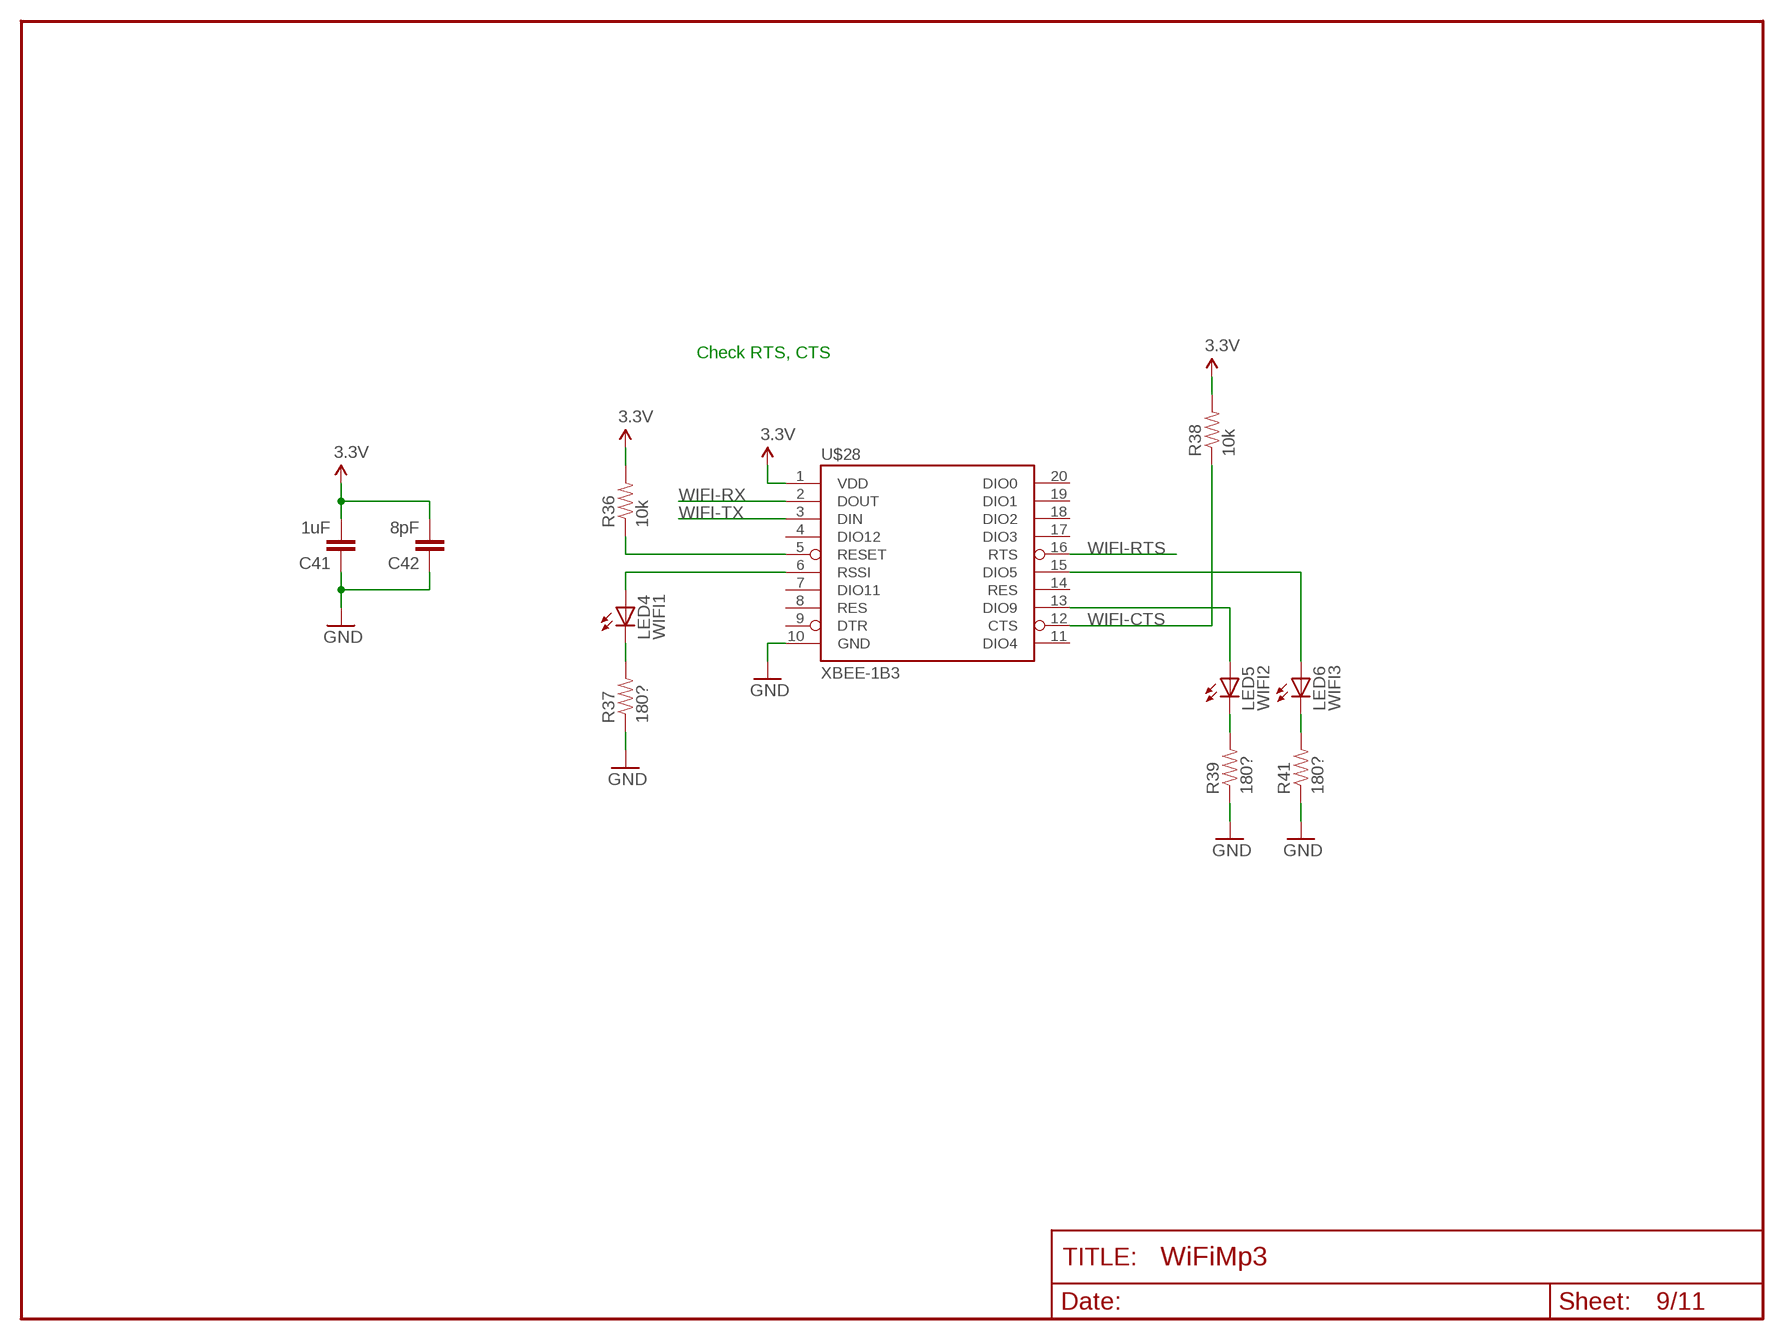
[diagram p8: schematic, sheet 9]

### Parts
C41  1uF  CAP0805  [0805]
C42  8pF  CAP0805  [0805]
LED4  WIFI1  LED1206  [LED-1206]
LED5  WIFI2  LED1206  [LED-1206]
LED6  WIFI3  LED1206  [LED-1206]
R36  10k  RESISTOR0805-RES  [0805]
R37  180?  RESISTOR0805-RES  [0805]
R38  10k  RESISTOR0805-RES  [0805]
R39  180?  RESISTOR0805-RES  [0805]
R41  180?  RESISTOR0805-RES  [0805]
U$28  XBEE-1B3  [XBEE-SMD]

### Nets
3.3V: C41.2 C42.2 R36.2 R38.2 U$28.1(VDD) ; also sheet 2,5,6,7,8,10,11
GND: C41.1 C42.1 R37.1 R39.1 R41.1 U$28.10(GND) ; also sheet 1,2,3,4,5,6,7,8,10,11
N$34: R36.1 U$28.5(RESET)
N$35: LED5.A U$28.13(DIO9)
N$36: LED4.A U$28.6(RSSI)
N$37: LED4.C R37.2
N$38: LED6.A U$28.15(DIO5)
N$39: LED5.C R39.2
N$40: LED6.C R41.2
WIFI-CTS: R38.1 U$28.12(CTS) ; also sheet 5
WIFI-RTS: U$28.16(RTS) ; also sheet 5
WIFI-RX: U$28.2(DOUT) ; also sheet 5
WIFI-TX: U$28.3(DIN) ; also sheet 5
Unconnected: U$28.4(DIO12) U$28.7(DIO11) U$28.8(RES) U$28.9(DTR) U$28.11(DIO4) U$28.14(RES) U$28.17(DIO3) U$28.18(DIO2) U$28.19(DIO1) U$28.20(DIO0)

### Notes on the sheet
- Check RTS, CTS

## Sheet 10 of 11
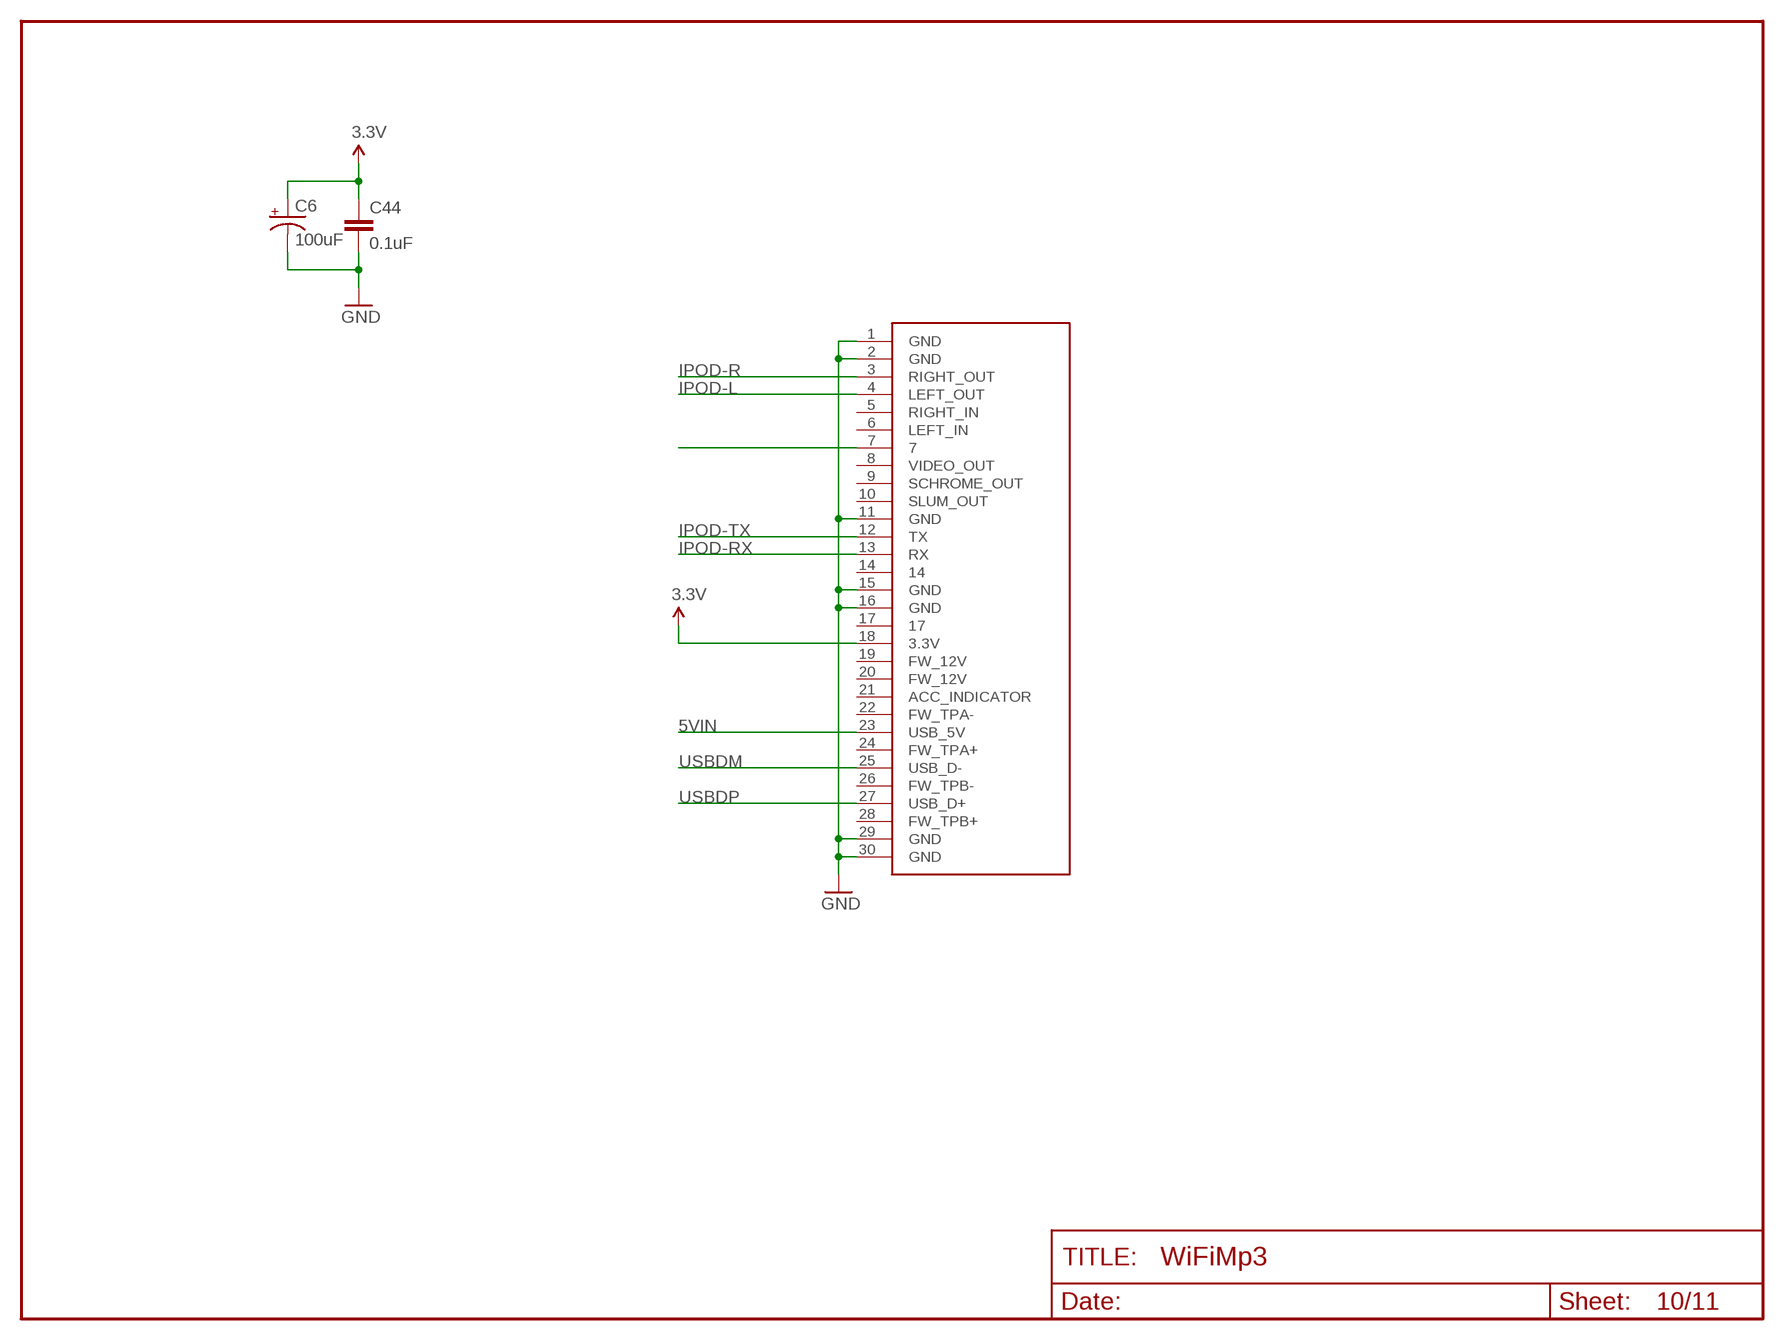
[diagram p9: schematic, sheet 10]

### Parts
C6  100uF  CAP_POL1206  [EIA3216]
C44  0.1uF  CAP0805  [0805]
J1  IPOD_FEMALE_CONNECTOR  [IPOD_FEMALE_CONNECTOR]

### Nets
3.3V: C6.A(+) C44.1 J1.18(3.3V) ; also sheet 2,5,6,7,8,9,11
5VIN: J1.23(USB_5V) ; also sheet 1
GND: C6.C(-) C44.2 J1.1(GND) J1.2(GND) J1.11(GND) J1.15(GND) J1.16(GND) J1.29(GND) J1.30(GND) ; also sheet 1,2,3,4,5,6,7,8,9,11
IPOD-L: J1.4(LEFT_OUT) ; also sheet 6
IPOD-R: J1.3(RIGHT_OUT) ; also sheet 6
IPOD-RX: J1.13(RX) ; also sheet 5
IPOD-TX: J1.12(TX) ; also sheet 5
N$41: J1.7
USBDM: J1.25(USB_D-) ; also sheet 1,5
USBDP: J1.27(USB_D+) ; also sheet 1,5
Unconnected: J1.5(RIGHT_IN) J1.6(LEFT_IN) J1.8(VIDEO_OUT) J1.9(SCHROME_OUT) J1.10(SLUM_OUT) J1.14 J1.17 J1.19(FW_12V) J1.20(FW_12V) J1.21(ACC_INDICATOR) J1.22(FW_TPA-) J1.24(FW_TPA+) J1.26(FW_TPB-) J1.28(FW_TPB+)

## Sheet 11 of 11
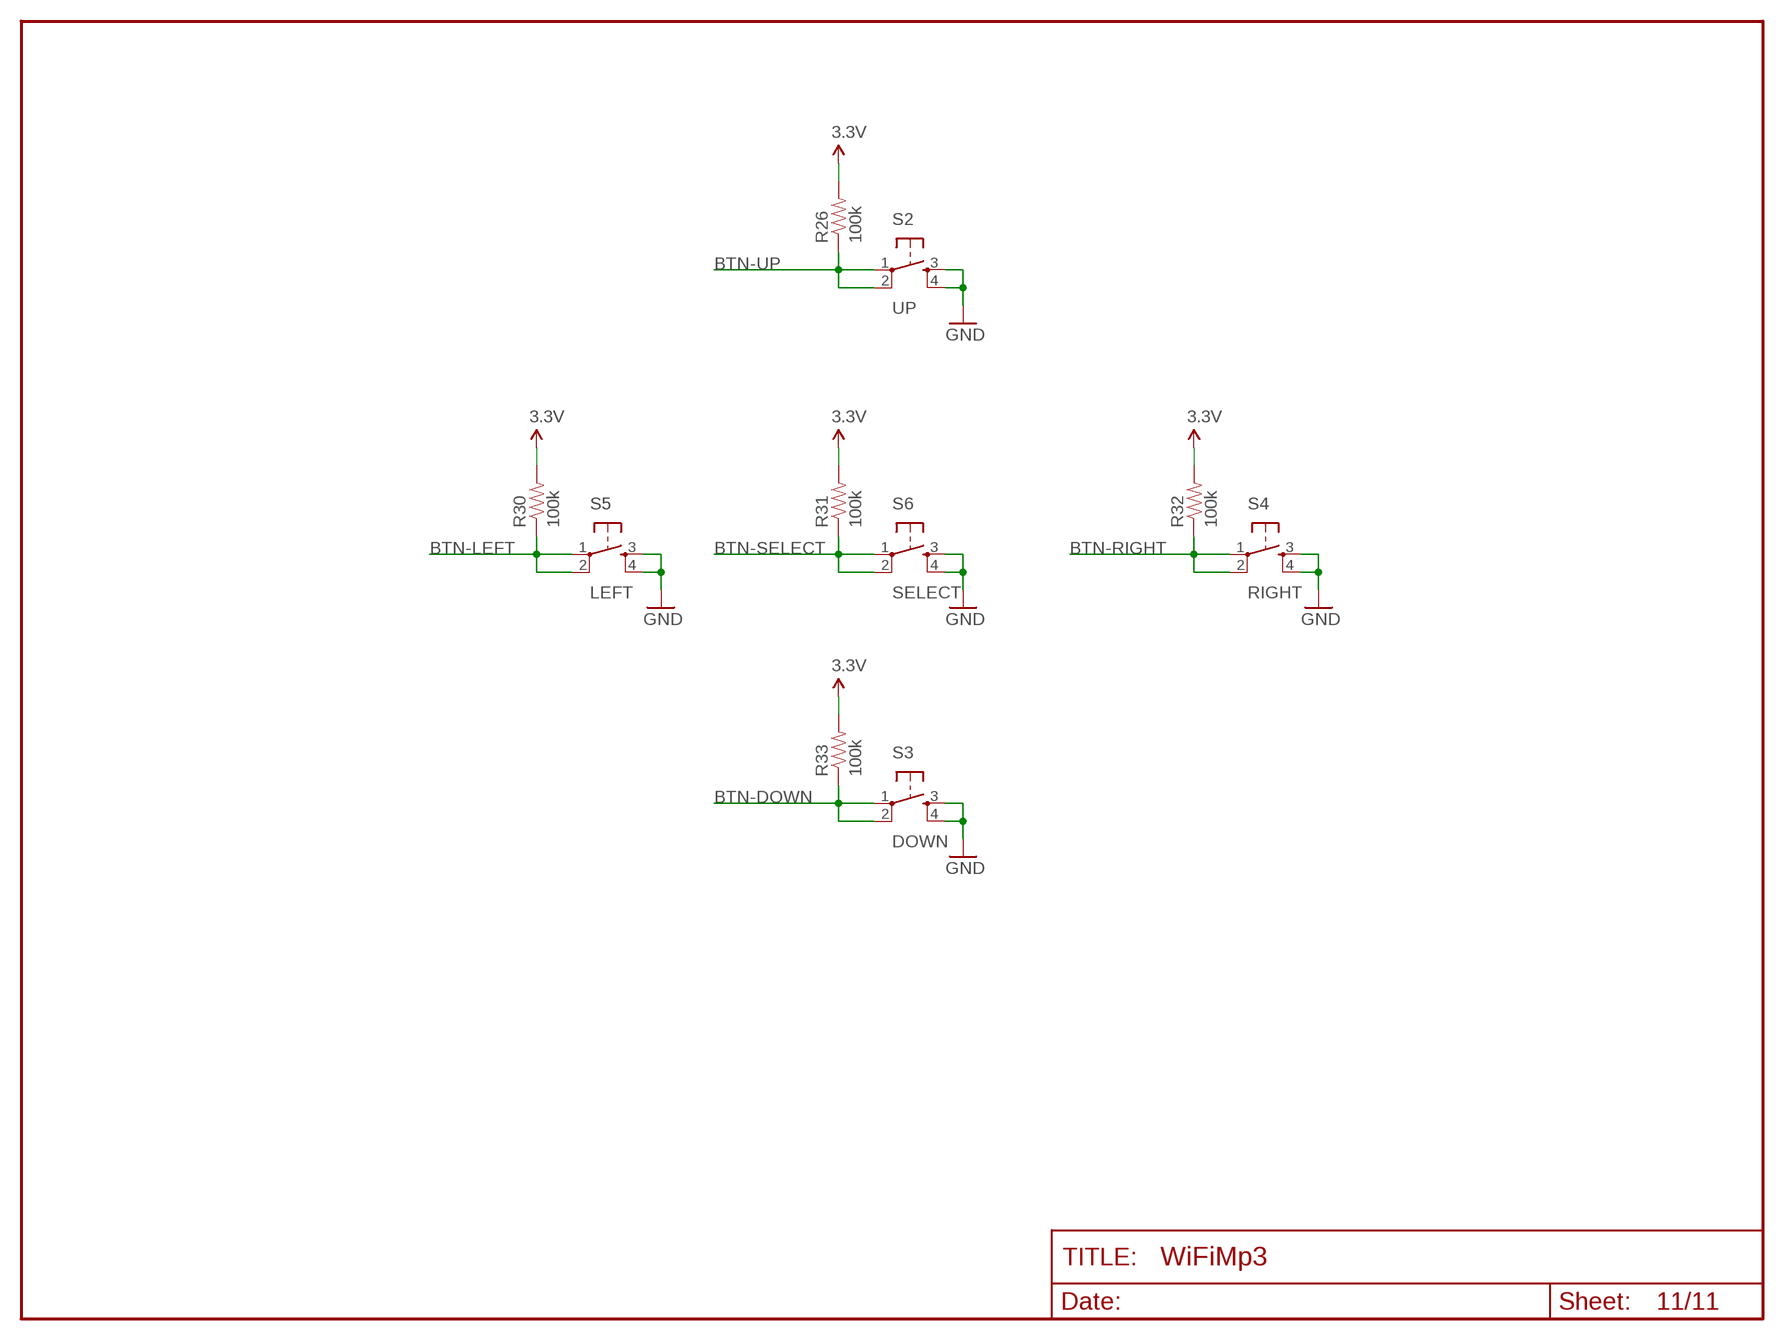
[diagram p10: schematic, sheet 11]

### Parts
R26  100k  RESISTOR0805-RES  [0805]
R30  100k  RESISTOR0805-RES  [0805]
R31  100k  RESISTOR0805-RES  [0805]
R32  100k  RESISTOR0805-RES  [0805]
R33  100k  RESISTOR0805-RES  [0805]
S2  UP  TAC_SWITCHSMD  [TACTILE_SWITCH_SMD]
S3  DOWN  TAC_SWITCHSMD  [TACTILE_SWITCH_SMD]
S4  RIGHT  TAC_SWITCHSMD  [TACTILE_SWITCH_SMD]
S5  LEFT  TAC_SWITCHSMD  [TACTILE_SWITCH_SMD]
S6  SELECT  TAC_SWITCHSMD  [TACTILE_SWITCH_SMD]

### Nets
3.3V: R26.2 R30.2 R31.2 R32.2 R33.2 ; also sheet 2,5,6,7,8,9,10
BTN-DOWN: R33.1 S3.1 S3.2 ; also sheet 5
BTN-LEFT: R30.1 S5.1 S5.2 ; also sheet 5
BTN-RIGHT: R32.1 S4.1 S4.2 ; also sheet 5
BTN-SELECT: R31.1 S6.1 S6.2 ; also sheet 5
BTN-UP: R26.1 S2.1 S2.2 ; also sheet 5
GND: S2.3 S2.4 S3.3 S3.4 S4.3 S4.4 S5.3 S5.4 S6.3 S6.4 ; also sheet 1,2,3,4,5,6,7,8,9,10

## Library data of the parts
C1-C5 C7 C8 C10 C12-C19 C21 C22 C24 C26-C42 C44 = SparkFun:CAP: Capacitor Standard 0603 ceramic capacitor, and 0.1" leaded capacitor.
C6 C9 C11 C20 C23 C25 C43 = SparkFun:CAP_POL: Capacitor Polarized These are standard SMD and PTH capacitors. Normally 10uF, 47uF, and 100uF in electrolytic and tantalum varieties. Always verify the external diameter of the through hole cap, it varies with capacity, voltage, and manufacturer. The EIA devices should be standard.
D1 = SparkFun:DIODE: Diode These are standard reverse protection diodes and small signal diodes. SMA package can handle up to about 1A. SOD-323 can handle about 200mA. What the SOD-323 package when ordering, there are some mfgs out there that are 5-pin packages.
J1 = FiveVolt:IPOD_FEMALE_CONNECTOR
JP1 JP3-JP8 = SparkFun:M01: Header 1 Standard 1-pin 0.1" header. Use with straight break away headers (SKU : PRT-00116), right angle break away headers (PRT-00553), swiss pins (PRT-00743), machine pins (PRT-00117), and female headers (PRT-00115).
JP2 = SparkFun:M02: Header 2 Standard 2-pin 0.1" header. Use with straight break away headers (SKU : PRT-00116), right angle break away headers (PRT-00553), swiss pins (PRT-00743), machine pins (PRT-00117), and female headers (PRT-00115). Molex polarized connector foot print use with SKU : PRT-08233 with associated crimp pins and housings.
JP9 JP10 = SparkFun:JUMPER-2: Jumper Basic 0.1" spaced jumper. Use with breakaway headers.
JP11 = SparkFun:M03: Header 3 Standard 3-pin 0.1" header. Use with straight break away headers (SKU : PRT-00116), right angle break away headers (PRT-00553), swiss pins (PRT-00743), machine pins (PRT-00117), and female headers (PRT-00115). Molex polarized connector foot print use with SKU : PRT-08232 with associated crimp pins and housings.
JP12 = SparkFun:M05X2: Header 5x2 Standard 10-pin dual row 0.1" header. Commonly used with AVR-ISP. Use with Spark Fun Electronics SKU: PRT-00778
L1 L2 = SparkFun:INDUCTOR: Inductors Basic Inductor/Choke - 0603 and 1206. Footprints are not proven and vary greatly between part numbers.
LED1-LED6 = SparkFun:LED: LEDs Standard schematic elements and footprints for 5mm, 3mm, 1206, and 0603 sized LEDs. 5mm - Spark Fun Electronics SKU : COM-00529 (and others)
Q1 Y1 = SparkFun:CRYSTAL: Crystals Various standard crystals. Proven footprints. Spark Fun Electronics SKU : COM-00534
Q2 = SparkFun:MOSFET-NCHANNEL
Q3 = FiveVolt:CRYSTAL
R1-R45 = SparkFun:RESISTOR: Resistor Basic schematic elements and footprints for 0603, 1206, and PTH resistors.
S1-S6 = SparkFun:TAC_SWITCH: Momentary Switch Button commonly used for reset or general input. Spark Fun Electronics SKU : COM-00097
U1 = FiveVolt:MCP73871: Stand-Alone System Load Sharing and Li-Ion / Li-Polymer Battery Charge Management Controller
U2 = SparkFun:TPS61200: DC to DC Booster
U3 = SparkFun:MC34063
U4 = SparkFun:VS1033
U5 = SparkFun:USD-SOCKET: microSD Socket Push-push type uSD socket. Schematic element and footprint production proven. Spark Fun Electronics SKU : PRT-00127. tDoc lines correctly indicate media card edge positions when inserting (unlocked, locked, depressed).
U$2 = FiveVolt:STM32F103
U$4 = SparkFun:OSHW-LOGO: Open Source Hardware Logo This logo indicates the piece of hardware it is found on incorporates a OSHW license and/or adheres to the definition of open source hardware found here: http://freedomdefined.org/OSHW
U$7 U$12 = SparkFun:V_REG_LDO: Voltage Regulator LDO Standard 150mA LDO voltage regulator in SOT-23 layout. Micrel part MIC5205. BP (by-pass) pin is used to lower output noise with 470pF cap.
U$20 = SparkFun:NOKIA6100_LCD: Nokia 6100 Color LCD Schematic element and footprint production proven but could use some touching up. Spark Fun Electronics SKU : LCD-00569. Mating SMD connector : LCD-00570
U$26 = SparkFun:AUDIO-JACK2
U$28 = SparkFun:XBEE-1
X1 = SparkFun:USB: USB Connectors USB-B-PTH is fully proven SKU : PRT-00139 USB-miniB is fully proven SKU : PRT-00587 USB-A-PCB is untested. USB-A-H is throughly reviewed, but untested. Spark Fun Electronics SKU : PRT-00437 USB-B-SMT is throughly reviewed, but untested. Needs silkscreen touching up. USB-A-S has not been used/tested USB-MB-H has not been used/tested

## Board
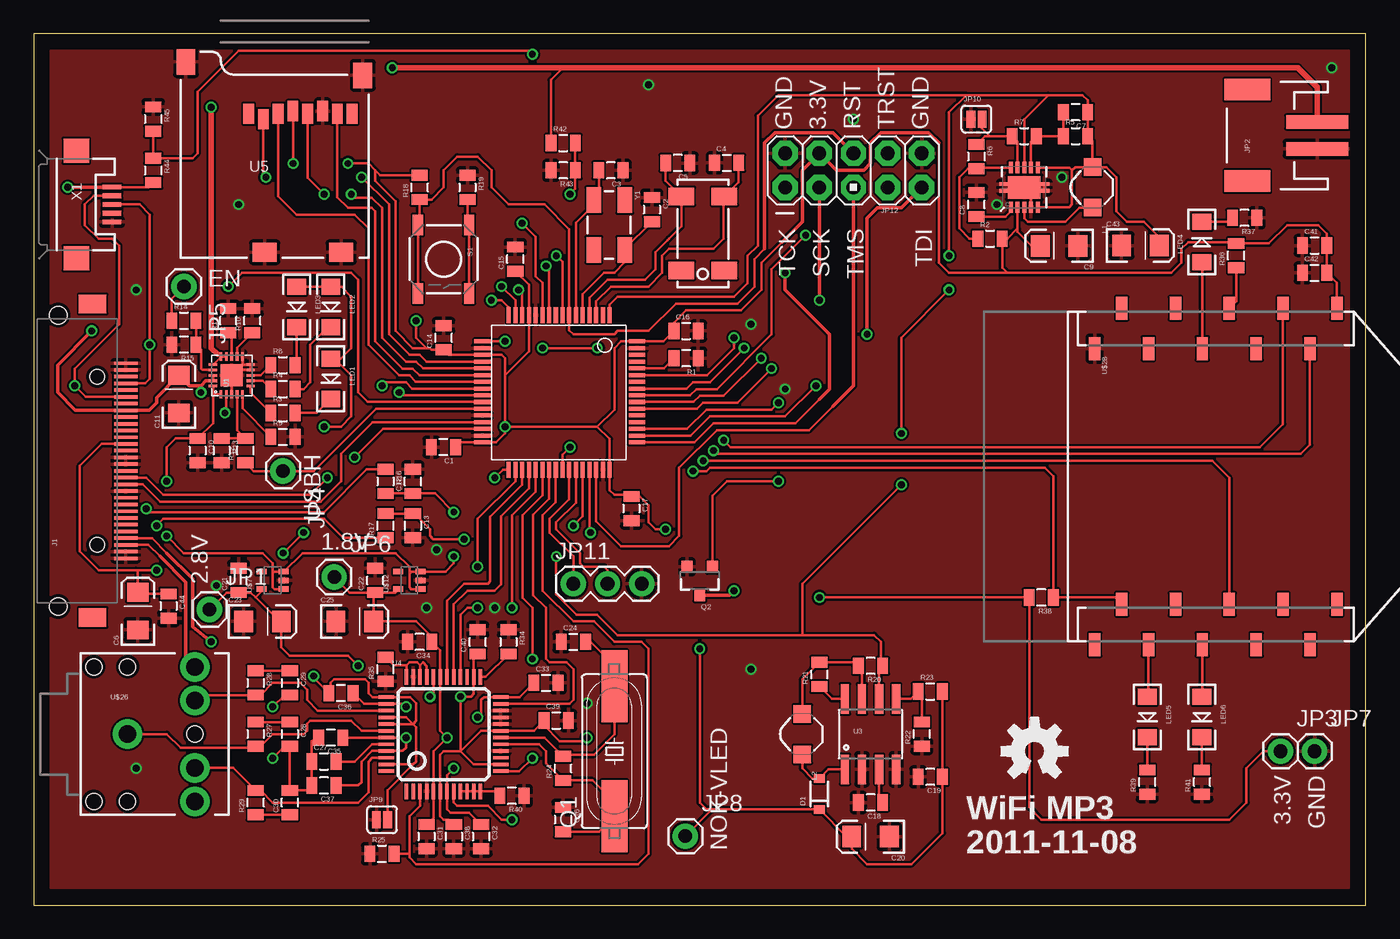
[diagram p11: board, top side]
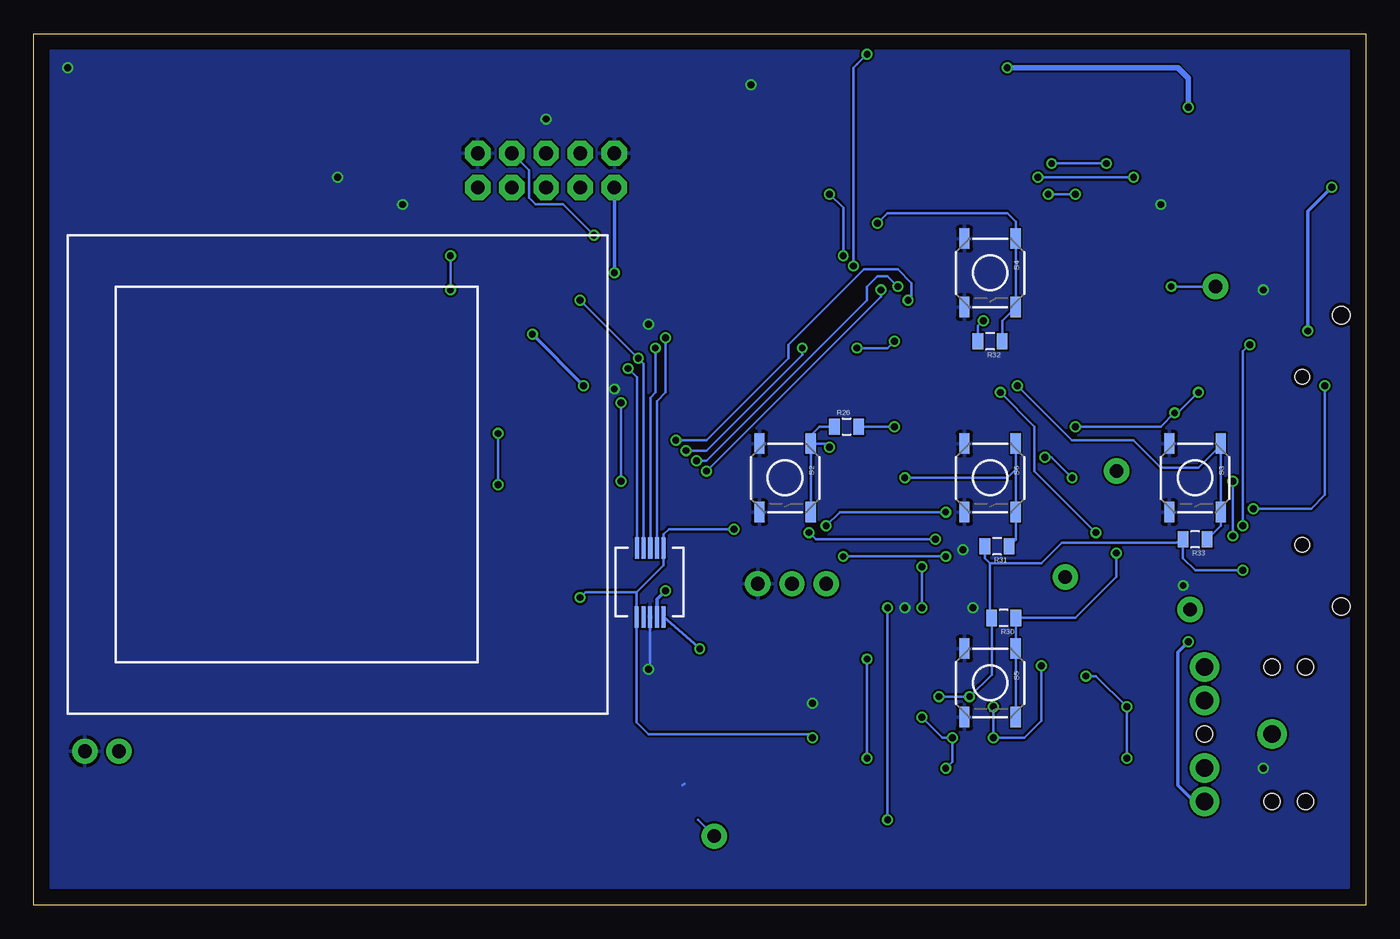
[diagram p12: board, bottom side, seen from below]

Size 99.06 x 64.77 mm. Coordinates in mm from the lower left corner, seen from the top.
Outline: 0,0 99.06,0 99.06,64.77 0,64.77 0,0
Copper layers (1*16): Top 0.035mm / dielectric 1.5mm / Bottom 0.035mm
Design rules "ITead_rule": minimum track width 6mil, minimum drill 12mil, track to track 6mil, track to pad 6mil, pad to pad 6mil, via to via 6mil, smd to smd 0mil, copper to edge 10mil, drill to drill 10mil, minimum pad ring 10mil, minimum via ring 6mil, stop-mask expansion 2mil, vias tented up to drill 100mil, thermal gap 10mil

### Footprints (pad centres in the part's own frame; a part is rotated, then mirrored left to right if it is on the bottom)
0805 = smd 0.8 x 1.2: 1 -0.9,0; 2 0.9,0
EIA3216 = smd 1.4 x 1.6: A 1.4,0; C -1.4,0
SOD-323 = smd 0.63 x 0.83: 1 -1.15,0; 2 1.15,0
IPOD_FEMALE_CONNECTOR = smd 0.254 x 1.75: 1 -7.25,0; 2 -6.75,0; 3 -6.25,0; 4 -5.75,0; 5 -5.25,0; 6 -4.75,0; 7 -4.25,0; 8 -3.75,0; 9 -3.25,0; 10 -2.75,0; 11 -2.25,0; 12 -1.75,0; 13 -1.25,0; 14 -0.75,0; 15 -0.25,0; 16 0.25,0; 17 0.75,0; 18 1.25,0; 19 1.75,0; 20 2.25,0; 21 2.75,0; 22 3.25,0; 23 3.75,0; 24 4.25,0; 25 4.75,0; 26 5.25,0; 27 5.75,0; 28 6.25,0; 29 6.75,0; 30 7.25,0 | smd 1.4 x 2.05: 31 -11.65,2.475; 32 11.65,2.475 | hole 1.1: 6.25,2.125; -6.25,2.125 | hole 1.3: 10.825,5.025; -10.825,5.025
1X01 = drill 1.016 pad 1.88 round: 1 0,0
JST-2-SMD = smd 1 x 4.6: 1 -1,-3.7; 2 1,-3.7 | smd 1.6 x 3.4: NC1 -3.4,1.5; NC2 3.4,1.5
SJ_2S = smd 0.635 x 1.27: 1 -0.412,0; 2 0.412,0
1X03 = drill 1.016 pad 1.88 round: 1 0,0; 2 2.54,0; 3 5.08,0
AVR_ICSP = drill 1.016 pad 1.88 octagon: 1 -1.27,5.08; 2 1.27,5.08; 3 -1.27,2.54; 4 1.27,2.54; 5 -1.27,0; 6 1.27,0; 7 -1.27,-2.54; 8 1.27,-2.54; 9 -1.27,-5.08; 10 1.27,-5.08
CDRH2D09 = smd 1.3 x 1.3: P$1 -1.5,0; P$2 1.5,0
LED-1206 = smd 1.2 x 1.4: A -1.5,0; C 1.5,0
HC49UP = smd 5.334 x 1.93: 1 -4.826,0; 2 4.826,0
SOT23-3 = smd 0.8 x 0.9: 1 -0.95,-1; 2 0.95,-1; 3 0,1.1
SOJ-4-5.5MM = smd 1.3 x 1.9: P1 -2.75,-1.6; P2 2.75,-1.6; P3 2.75,1.6; P4 -2.75,1.6
TACTILE_SWITCH_SMD = smd 1.524 x 0.762: 1 -2.54,1.905; 2 2.54,1.905; 3 -2.54,-1.905; 4 2.54,-1.905
QFN-20 = smd 0.6 x 0.2: 1 -1.4,0.8; 2 -1.4,0.4; 3 -1.4,0; 4 -1.4,-0.4; 5 -1.4,-0.8; 11 1.4,-0.8; 12 1.4,-0.4; 13 1.4,0; 14 1.4,0.4; 15 1.4,0.8 | smd 0.2 x 0.6: 6 -0.8,-1.4; 7 -0.4,-1.4; 8 0,-1.4; 9 0.4,-1.4; 10 0.8,-1.4; 16 0.8,1.4; 17 0.4,1.4; 18 0,1.4; 19 -0.4,1.4; 20 -0.8,1.4 | smd 1.651 x 1.651: PEP 0,0
QFN-10_PAD = smd 0.297 x 0.85: 1 -1,-1.475; 2 -0.5,-1.475; 3 0,-1.475; 4 0.5,-1.475; 5 1,-1.475; 6 1,1.475; 7 0.5,1.475; 8 0,1.475; 9 -0.5,1.475; 10 -1,1.475 | smd 0.7 x 0.28: 11 -1.5,0.25; 12 -1.5,-0.25; 13 1.5,0.25; 14 1.5,-0.25 | smd 2.4 x 1.65: 15 0,0
SO08 = smd 0.61 x 2.21: 1 -1.905,-2.616; 2 -0.635,-2.616; 3 0.635,-2.616; 4 1.905,-2.616; 5 1.905,2.616; 6 0.635,2.616; 7 -0.635,2.616; 8 -1.905,2.616
LQFP-48 = smd 0.254 x 1.143: 1 -2.75,-4.25; 2 -2.25,-4.25; 3 -1.75,-4.25; 4 -1.25,-4.25; 5 -0.75,-4.25; 6 -0.25,-4.25; 7 0.25,-4.25; 8 0.75,-4.25; 9 1.25,-4.25; 10 1.75,-4.25; 11 2.25,-4.25; 12 2.75,-4.25; 25 2.75,4.25; 26 2.25,4.25; 27 1.75,4.25; 28 1.25,4.25; 29 0.75,4.25; 30 0.25,4.25; 31 -0.25,4.25; 32 -0.75,4.25; 33 -1.25,4.25; 34 -1.75,4.25; 35 -2.25,4.25; 36 -2.75,4.25 | smd 1.143 x 0.254: 13 4.25,-2.75; 14 4.25,-2.25; 15 4.25,-1.75; 16 4.25,-1.25; 17 4.25,-0.75; 18 4.25,-0.25; 19 4.25,0.25; 20 4.25,0.75; 21 4.25,1.25; 22 4.25,1.75; 23 4.25,2.25; 24 4.25,2.75; 37 -4.25,2.75; 38 -4.25,2.25; 39 -4.25,1.75; 40 -4.25,1.25; 41 -4.25,0.75; 42 -4.25,0.25; 43 -4.25,-0.25; 44 -4.25,-0.75; 45 -4.25,-1.25; 46 -4.25,-1.75; 47 -4.25,-2.25; 48 -4.25,-2.75
MICRO-SD-SOCKET-PP = smd 0.8 x 1.5: 1 -8.94,10.7; 2 -7.84,10.3; 3 -6.74,10.7; 4 -5.64,10.9; 5 -4.54,10.7; 6 -3.44,10.9; 7 -2.34,10.7; 8 -1.24,10.7 | smd 1.8 x 1.4: CD1 -2.05,0.4; CD2 -7.75,0.4 | smd 1.4 x 1.9: GND1 -13.6,14.55; GND3 -0.45,13.55
TQFP-10X10-64 = smd 1.2 x 0.3: P$1 -5.75,3.71; P$2 -5.75,3.21; P$3 -5.75,2.71; P$4 -5.75,2.21; P$5 -5.75,1.71; P$6 -5.75,1.21; P$7 -5.75,0.71; P$8 -5.75,0.21; P$9 -5.75,-0.29; P$10 -5.75,-0.79; P$11 -5.75,-1.29; P$12 -5.75,-1.79; P$13 -5.75,-2.29; P$14 -5.75,-2.79; P$15 -5.75,-3.29; P$16 -5.75,-3.79; P$33 5.75,-3.79; P$34 5.75,-3.29; P$35 5.75,-2.79; P$36 5.75,-2.29; P$37 5.75,-1.79; P$38 5.75,-1.29; P$39 5.75,-0.79; P$40 5.75,-0.29; P$41 5.75,0.21; P$42 5.75,0.71; P$43 5.75,1.21; P$44 5.75,1.71; P$45 5.75,2.21; P$46 5.75,2.71; P$47 5.75,3.21; P$48 5.75,3.71 | smd 0.3 x 1.2: P$17 -3.79,-5.75; P$18 -3.29,-5.75; P$19 -2.79,-5.75; P$20 -2.29,-5.75; P$21 -1.79,-5.75; P$22 -1.29,-5.75; P$23 -0.79,-5.75; P$24 -0.29,-5.75; P$25 0.21,-5.75; P$26 0.71,-5.75; P$27 1.21,-5.75; P$28 1.71,-5.75; P$29 2.21,-5.75; P$30 2.71,-5.75; P$31 3.21,-5.75; P$32 3.71,-5.75; P$49 3.71,5.75; P$50 3.21,5.75; P$51 2.71,5.75; P$52 2.21,5.75; P$53 1.71,5.75; P$54 1.21,5.75; P$55 0.71,5.75; P$56 0.21,5.75; P$57 -0.29,5.75; P$58 -0.79,5.75; P$59 -1.29,5.75; P$60 -1.79,5.75; P$61 -2.29,5.75; P$62 -2.79,5.75; P$63 -3.29,5.75; P$64 -3.79,5.75
SC70 = smd 0.4 x 0.75: 1 -0.65,-0.825; 2 0,-0.825; 3 0.65,-0.825; 4 0.65,0.825; 5 -0.65,0.825
NOKIA6100_LCD = smd 1.6 x 0.3: 1 24.255,44.311; 2 24.255,43.811; 3 24.255,43.311; 4 24.255,42.811; 5 24.255,42.311; 6 29.389,42.303; 7 29.389,42.803; 8 29.389,43.303; 9 29.389,43.803; 10 29.389,44.303
AUDIO-JACK = drill 1.3 pad 2.184 round: RING 5,5; RSH 5,2.5; SLEEVE 0,0; TIP 5,-5; TSH 5,-2.5 | hole 1.2: 0,5; -2.5,5; -2.5,-5; 0,-5; 5,0
XBEE-SMD = smd 1.7 x 0.85: 1 -12.5,20; 2 -9.5,18; 3 -12.5,16; 4 -9.5,14; 5 -12.5,12; 6 -9.5,10; 7 -12.5,8; 8 -9.5,6; 9 -12.5,4; 10 -9.5,2; 11 12.5,2; 12 9.5,4; 13 12.5,6; 14 9.5,8; 15 12.5,10; 16 9.5,12; 17 12.5,14; 18 9.5,16; 19 12.5,18; 20 9.5,20
USB-MICROB = smd 0.35 x 1.4: D+ 0,2.65; D- -0.65,2.65; GND 1.3,2.65; ID 0.65,2.65; VBUS -1.3,2.65 | smd 1.8 x 1.9: MT1 -4,0; MT2 4,0
CRYSTAL-SMD-5X3 = smd 1.9 x 1.1: 1 -1.85,-1.15; 2 1.85,-1.15; 3 1.85,1.15; 4 -1.85,1.15

### Placement (x,y rotation side)
C1  30.48,34.04 180 top
C2  45.97,51.69 270 top
C3  42.93,54.61 180 top
C4  51.52,55.17 0 top
C5  47.9,55.15 180 top
C6  7.75,21.84 90 top
C7  77.47,58.93 180 top
C8  70.1,52.07 90 top
C9  76.25,49 180 top
C10  12.19,33.78 270 top
C11  10.79,37.97 90 top
C12  28.19,31.5 90 top
C13  28.19,28.19 270 top
C14  30.48,42.16 90 top
C15  35.81,48.01 90 top
C16  48.51,42.67 0 top
C17  44.45,29.46 270 top
C18  62.23,7.62 180 top
C19  66.67,9.53 180 top
C20  62.23,5.08 180 top
C21  15.24,24.13 90 top
C22  25.4,24.13 90 top
C23  17.02,21.08 0 top
C24  40.13,19.56 0 top
C25  23.88,21.08 0 top
C26  39.37,6.35 270 top
C27  21.59,10.67 0 top
C28  19.05,12.7 270 top
C29  19.05,16.51 270 top
C30  19.05,7.62 90 top
C31  29.21,5.08 270 top
C32  33.27,5.08 270 top
C33  38.1,16.51 0 top
C34  28.7,19.56 180 top
C35  22.1,12.45 180 top
C36  22.86,15.75 180 top
C37  21.59,8.89 180 top
C38  31.24,5.08 270 top
C39  38.86,13.72 0 top
C40  33.02,19.56 90 top
C41  95.25,49.02 0 top
C42  95.25,46.99 0 top
C43  82.3,49.02 0 top
C44  10.03,22.23 270 top
D1  58.42,8.26 90 top
J1  6.86,33.02 90 top
JP1  13.08,21.97 0 top
JP2  91.74,57.2 90 top
JP3  92.71,11.43 0 top
JP4  18.54,32.26 270 top
JP5  11.18,45.97 270 top
JP6  22.35,24.38 0 top
JP7  95.25,11.43 0 top
JP8  48.46,5.12 0 top
JP9  25.91,6.35 0 top
JP10  70.1,58.42 0 top
JP11  40.13,23.88 0 top
JP12  60.96,54.61 90 top
L1  78.74,53.34 270 top
L2  57.15,12.7 270 top
LED1  22.1,39.12 270 top
LED2  22.1,44.45 270 top
LED3  19.56,44.45 270 top
LED4  86.87,49.28 90 top
LED5  82.8,13.97 270 top
LED6  86.87,13.97 270 top
Q1  43.18,11.43 90 top
Q2  49.53,24.13 180 top
Q3  49.76,49.92 270 top
R1  48.51,40.64 180 top
R2  71.12,49.53 0 top
R3  18.54,36.58 0 top
R4  18.54,38.35 0 top
R5  77.47,57.15 0 top
R6  70.1,55.63 270 top
R7  73.66,57.15 0 top
R8  18.54,40.13 0 top
R9  18.54,34.8 0 top
R10  16.26,43.43 90 top
R11  14.48,43.43 90 top
R12  15.75,33.78 90 top
R13  13.97,33.78 270 top
R14  11.18,43.43 0 top
R15  11.18,41.66 180 top
R16  26.16,31.5 270 top
R17  26.16,28.19 90 top
R18  28.7,53.34 90 top
R19  32.26,53.34 270 top
R20  62.23,17.78 180 top
R21  58.42,17.14 90 top
R22  66.04,12.7 90 top
R23  66.67,15.88 0 top
R24  39.37,10.16 90 top
R25  25.91,3.81 0 top
R26  38.61,35.56 0 bottom
R27  16.51,12.7 270 top
R28  16.51,16.51 270 top
R29  16.51,7.62 90 top
R30  26.92,21.34 180 bottom
R31  27.43,26.67 180 bottom
R32  27.94,41.91 180 bottom
R33  12.7,27.18 180 bottom
R34  35.31,19.56 270 top
R35  26.16,17.53 90 top
R36  89.41,48.28 90 top
R37  90.05,51.07 180 top
R38  74.93,22.86 180 top
R39  82.8,9.14 90 top
R40  35.56,8.13 180 top
R41  86.87,9.14 90 top
R42  39.37,56.64 0 top
R43  39.37,54.61 180 top
R44  8.89,54.61 270 top
R45  8.89,58.42 270 top
S1  30.48,48.01 270 top
S2  43.18,31.75 270 bottom
S3  12.7,31.75 270 bottom
S4  27.94,46.99 270 bottom
S5  27.94,16.51 270 bottom
S6  27.94,31.75 270 bottom
U1  14.73,39.37 90 top
U2  73.66,53.34 0 top
U3  62.23,12.7 0 top
U4  30.48,12.7 0 top
U5  24.92,48.12 0 top
U$2  39.12,38.1 270 top
U$4  74.42,11.43 0 top
U$7  17.78,24.13 90 top
U$12  27.94,24.13 90 top
U$20  96.52,50.8 270 bottom
U$26  6.99,12.7 0 top
U$28  76.9,31.86 270 top
X1  3.17,52.07 270 top
Y1  42.8,50.55 270 top

### Tracks (layer width: path | path; a pad name or v marks a point on that pad's centre or on a via)
1.8V  (via drill 0.51)
  Top 0.203: C31.1 29.73,6.5 U4.5 29.73,11.44 v30.73,12.45 30.23,12.95 U4.31 30.23,18.93 C34.1 29.6,19.93 28.45,21.08 C25.A 25.28,23.11 C22.1 | C32.1 32.4,6.86 30.99,6.86 30.73,7.12 U4.7 30.73,9.65 v31.24,10.16 | v33.02,13.97 33.27,14.22 33.27,15.24 33.48,15.45 U4.24 36.14,15.45 C33.1 | C22.1 23.51,23.23 JP6.1 | C22.1 26.86,23.23 U$12.5
  Bottom 0.203: v31.24,10.16 30.73,10.67 v30.73,12.45 31.5,12.45 v33.02,13.97
2.8V  (via drill 0.51)
  Top 0.203: C37.1 24.13,8.89 24.38,9.14 24.38,10.67 25.17,11.45 U4.45 27.45,11.45 27.69,11.68 v27.69,12.45 v27.68,12.45 U4.43 23.25,12.45 C35.1 | C36.1 24.56,14.95 U4.38 27.47,14.95 v27.69,14.73 | JP1.1 14.34,23.23 C21.1 16.14,23.23 16.51,22.86 | 16.51,22.86 18.29,21.08 C23.A 18.42,19.17 19.05,18.54 23.37,18.54 v24.13,17.78 | U$7.5 16.95,23.3 16.51,22.86
  Bottom 0.203: v27.69,14.73 v27.69,12.45 25.4,12.45 24.13,13.72 v24.13,17.78
3.3V  (via drill 0.51)
  Top 0.203: C38.1 30.87,6.35 30.48,6.35 30.23,6.6 U4.6 30.23,11.18 30.48,11.43 31.75,11.43 | U4.14 32.73,10.45 31.75,11.43 | 31.75,11.43 33.27,12.95 U4.19 37.2,12.95 C39.1 37.96,13.35 39.12,12.19 40.89,12.19 v41.15,12.45 | 31.75,11.43 v31.75,15.49 32.51,15.49 32.73,15.71 U4.26 32.73,18.37 C40.1 | U4.32 29.73,15.76 v29.46,15.49 | C17.1 44.35,30.46 | C17.1 45.07,30.36 45.72,29.72 45.72,28.45 46.23,27.94 v46.99,27.94 | U5.4 19.28,55.14 v19.3,55.12 | v23.37,55.12 24.89,55.12 25.4,54.61 | 25.4,54.61 25.4,53.85 26.92,52.32 26.92,42.67 28.19,41.4 29.21,41.4 | v58.42,22.86 R38.2 74.03,7.25 74.93,6.35 88.9,6.35 90.17,7.62 90.17,10.16 91.44,11.43 JP3.1 | U$28.1 96.9,46.24 C42.2 C41.2 96.15,49.9 95.5,50.55 93.22,50.55 91.85,49.18 R36.2 89.31,49.28 85.85,49.28 85.34,48.77 85.34,47.75 84.58,46.99 72.39,46.99 | 67.31,56.64 67.31,47.75 68.07,46.99 72.39,46.99 | 72.39,46.99 72.02,47.36 R2.2 72.39,49.53 73.16,50.3 | J1.18 5.06,34.27 3.43,32.64 3.43,26.29 4.83,24.89 7.62,24.89 | 7.62,24.89 v9.14,24.89 | 73.16,50.3 U2.2 | 73.16,50.3 73.16,50.03 74.19,49 C9.A | C17.1 44.33,30.48 43.18,30.48 42.83,30.83 U$2.P$48 42.83,34.64 41.91,35.56 | 41.91,35.56 v35.05,35.56 | v35.05,35.56 35.05,35.05 34.39,34.39 U$2.P$32 31.73,34.39 C1.1 | 29.21,41.4 29.46,41.4 29.6,41.26 C14.1 30.85,40.89 U$2.P$19 34.79,40.89 34.8,40.89 35.05,40.64 35.05,39.37 | 29.21,41.4 28.45,42.16 v28.45,43.43 | v35.05,35.56 35.05,39.37 | 35.05,39.37 36.83,41.14 U$2.P$13 36.83,46.09 C15.1 | 41.91,35.56 43.18,36.83 43.18,41.4 43.67,41.89 U$2.P$64 46.83,41.89 C16.1 47.61,43.3 48.51,44.2 52.58,44.2 54.1,45.72 54.1,47.75 55.63,49.28
  Top 0.203: R18.2 25.77,54.24 25.4,54.61 | C6.A 7.75,24.77 7.62,24.89 | 7.87,23.12 C44.1
  Top 0.254: 55.63,49.28 57.15,50.8 57.15,54.61 JP12.4 59.69,54.61 61.72,54.61 62.23,55.12 62.23,56.64 62.99,57.4 66.55,57.4 67.31,56.64 | C6.A 7.87,23.12
  Bottom 0.203: v31.75,15.49 v29.46,15.49 27.82,17.13 R30.2 27.94,21.45 27.94,25.4 | v41.15,12.45 41.4,12.7 53.34,12.7 54.22,13.58 U$20.6 54.22,23.25 | 54.22,23.25 52.21,25.26 U$20.1 52.21,27.55 51.82,27.94 v46.99,27.94 | v23.37,55.12 v19.3,55.12 | v35.05,35.56 R26.2 | 54.22,23.25 58.03,23.25 v58.42,22.86 | R31.2 28.33,25.79 27.94,25.4 | 27.94,25.4 24.13,25.4 22.61,26.92 14.11,26.92 R33.2 13.6,25.79 12.7,24.89 v9.14,24.89 | R32.2 28.84,43.04 v28.45,43.43
3V3GND
  Top 0.203: 71.12,57.15 70.73,57.15 R6.1 | 71.12,57.15 R7.1 73.16,56.75 U2.9 | JP10.2 70.52,57.75 71.12,57.15
5VIN  (via drill 0.51)
  Top 0.203: U1.19 U1.18 | v2.54,53.34 2.57,53.37 | 12.45,38.61 v12.45,38.1 | U1.2 14.33,36.68 v14.22,36.58 | 19.28,46.23 LED3.A LED2.A 22.88,45.95 23.62,45.21 23.62,41.4 22.84,40.62 LED1.A 22.38,40.62 23.62,39.37 23.62,36.32 22.86,35.56 v21.59,35.56 | X1.VBUS 8.55,53.37 R44.2
  Top 0.254: 2.57,53.37 X1.VBUS | U1.19 12.81,38.97 12.45,38.61 11.56,38.61 C11.A 9.14,37.72 9.14,37.34 8.58,36.77 J1.23 3.11,36.77 1.78,38.1 1.78,40.13 v4.32,42.67
  Bottom 0.203: v12.45,38.1 13.97,36.58 v14.22,36.58 15.24,35.56 v21.59,35.56
  Bottom 0.254: v4.32,42.67 4.32,51.56 v2.54,53.34
AGND  (via drill 0.51)
  Top 0.203: C29.2 18.66,15.61 v17.78,14.73 | v17.78,10.92 18.66,11.8 C28.2 C30.2 20.32,8.52 C37.2 C27.1 20.69,12.19 C35.2 | 28.23,10.45 U4.47 | 28.23,10.45 28.45,10.67 28.45,13.21 28.21,13.45 | 28.21,13.45 U4.41 | U4.40 27.71,13.95 28.21,13.45 | 28.21,13.45 28.45,13.69 28.45,14.99 27.98,15.45 U4.37 25.19,15.45 24.89,15.75 24.89,16.51 24.64,16.76 22.35,16.76 22.1,16.51 22.1,15.89 C36.2 20.83,16.88 v20.83,17.02 | JP9.2 26.32,8.54 28.23,10.45
  Bottom 0.203: v17.78,10.92 v17.78,14.73 20.07,17.02 v20.83,17.02
AUDIO-GND
  Top 0.203: U$26.SLEEVE 9.91,12.7 10.92,11.68 16.39,11.68 R27.2 16.88,11.8 17.78,12.7 20.07,12.7 20.32,12.95 20.32,13.46 20.57,13.72 23.62,13.72 24.39,12.95 U4.42
AUDIO-L
  Top 0.203: U$26.TSH 14.83,10.2 R29.2 16.88,8.52 17.78,7.62 24.13,7.62 24.89,8.38 24.89,10.67 25.17,10.95 U4.46
AUDIO-R
  Top 0.203: U$26.RSH 12.39,15.61 R28.2 16.88,15.61 17.78,16.51 19.81,16.51 20.32,16 20.32,15.24 21.11,14.45 U4.39
BATT-LEVEL  (via drill 0.51)
  Top 0.203: U$2.P$8 39.33,47.8 v38.86,48.26 | v39.88,52.83 40.27,53.22 R43.1 R42.2
  Bottom 0.203: v38.86,48.26 38.86,51.82 v39.88,52.83
BTN-DOWN  (via drill 0.51)
  Top 0.203: U$2.P$24 28.16,38.39 27.69,38.86 26.16,38.86 v25.91,38.61
  Bottom 0.203: R33.1 10.79,28.18 S3.2 S3.1 10.79,34.16 12.45,32.51 15.24,32.51 17.27,34.54 21.84,34.54 v25.91,38.61
BTN-LEFT  (via drill 0.51)
  Top 0.203: v18.54,26.16 v20.07,27.69 | U$2.P$25 27.39,37.89 v27.18,38.1
  Bottom 0.203: S5.2 S5.1 26.04,21.32 R30.1 21.59,21.34 18.54,24.38 v18.54,26.16 | v20.07,27.69 24.64,32.26 24.64,35.56 v27.18,38.1
BTN-RIGHT  (via drill 0.51)
  Top 0.203: 36.35,50.64 v36.32,50.67 37.34,49.66 37.34,46.74 37.83,46.25 U$2.P$11
  Bottom 0.203: R32.1 27.04,43.45 S4.2 S4.1 26.04,50.8 26.67,51.44 35.56,51.44 v36.32,50.67
BTN-SELECT  (via drill 0.51)
  Top 0.203: U$2.P$33 34.89,32.35 v34.29,31.75
  Bottom 0.203: R31.1 26.04,27.17 S6.2 S6.1 26.04,32.38 26.67,31.75 v34.29,31.75
BTN-UP  (via drill 0.51)
  Top 0.203: U$2.P$41 39.33,33.48 v39.88,34.04
  Bottom 0.203: S2.1 S2.2 | S2.1 41.27,34.92 40.64,35.56 R26.1 | S2.1 40.13,34.29 v39.88,34.04
CRGUSBEN  (via drill 0.51)
  Top 0.203: R14.1 10.28,45.07 JP5.1 | v14.48,45.97 15.49,46.99 23.62,46.99 24.13,46.48 24.13,38.1 24.84,37.39 U$2.P$26
  Bottom 0.203: JP5.1 v14.48,45.97
CRGUSBHL
  Top 0.203: R12.1 16.37,32.26 JP4.1 20.83,32.26 25.46,36.89 U$2.P$27
DEBUG-RX
  Top 0.203: JP11.2 42.67,24.89 42.42,25.15 40.89,25.15 40.64,25.4 40.64,26.16 38.86,27.94 38.86,28.45 40.33,29.91 U$2.P$43
DEBUG-TX
  Top 0.203: JP11.1 40.13,25.91 38.35,27.69 38.35,28.7 39.83,30.17 U$2.P$42
FB
  Top 0.203: R2.1 69.6,49.53 68.83,50.29 68.83,54.1 69.46,54.73 R6.2 70.19,54.81 U2.10
GND  (via drill 0.51)
  Top 0.203: U1.3 U1.PEP 14.73,39.78 U1.9 U1.10 15.53,40.17 U1.11 | U2.14 U2.13 73.91,53.59 U2.15 | U2.12 73.41,53.09 U2.15 | U2.4 74.16,52.84 U2.15
  Bottom 0.203: 50.68,9.01 50.8,8.89 | U$20.8 53.22,17.66 v53.34,17.53
  other vias: 7.62,10.16 7.62,45.72 76.45,54.1 71.63,52.07 29.97,26.42 29.21,22.1 34.29,22.1 41.15,14.99 15.24,52.07 55.88,38.35 53.34,43.18 60.96,58.42 96.52,62.23 45.72,60.96 13.59,23.75
  pour Top: 1.27,1.27 1.27,63.5 97.79,63.5 97.79,1.27
  pour Bottom: 1.27,1.27 1.27,63.5 97.79,63.5 97.79,1.27
IPOD-L  (via drill 0.51)
  Top 0.203: J1.4 8.8,27.27 9.91,26.16
  Top 0.254: 9.91,26.16 11.81,24.26 11.81,20.7 v13.21,19.56
  Bottom 0.254: U$26.TIP 12.78,7.7 13.97,8.89 13.97,18.8 v13.21,19.56
IPOD-R
  Top 0.203: J1.3 8.54,26.77 9.4,25.91
  Top 0.254: 9.4,25.91 11.3,24 11.3,18.38 U$26.RING
IPOD-RX  (via drill 0.51)
  Top 0.203: J1.13 8.36,31.77 9.65,30.48 20.57,30.48 v21.84,31.75 | U$2.P$30 25.99,35.39 v23.88,33.27
  Bottom 0.203: v23.88,33.27 23.37,33.27 v21.84,31.75
IPOD-TX
  Top 0.203: J1.12 8.1,31.27 9.4,29.97 21.34,29.97 22.86,31.5 22.86,33.53 25.22,35.89 U$2.P$29
JTAG-RST
  Top 0.203: 54.36,48.77 53.59,48.01 53.59,45.97 52.32,44.7 47.75,44.7 45.72,42.67 43.43,42.67 43.18,42.42 40.13,42.42 39.83,42.72 U$2.P$7 39.83,50.22 37.97,52.07 35.31,52.07 34.04,53.34 34.04,54.61 33.02,55.63 31.5,55.63 30.48,54.61 30.48,53.34 29.58,52.44 R18.1 28.7,50.67 S1.3 S1.4
  Top 0.254: 54.36,48.77 54.36,56.64 55.12,57.4 59.44,57.4 JP12.6
JTAG-TCK  (via drill 0.51)
  Top 0.203: 58.42,37.59 56.64,35.81 50.55,35.81 49.12,34.39 U$2.P$49
  Top 0.254: 58.42,37.59 59.18,38.35 59.18,42.42 55.88,45.72 v55.88,46.99
  Bottom 0.254: v55.88,46.99 JP12.1
JTAG-TDI  (via drill 0.51)
  Top 0.203: v58.17,38.61 55.88,36.32 50.29,36.32 48.86,34.89 U$2.P$50
  Top 0.254: v61.98,42.42 61.98,51.05 62.74,51.82 64.52,51.82 JP12.9
  Bottom 0.254: v58.17,38.61 v61.98,42.42
JTAG-TMS
  Top 0.203: 59.44,37.08 57.66,35.31 50.8,35.31 48.01,32.51 48.01,27.43 47.24,26.67 43.69,26.67 41.83,28.53 U$2.P$46
  Top 0.254: 59.44,37.08 60.96,38.61 JP12.5
JTAG-TRST  (via drill 0.51)
  Top 0.203: v57.4,49.78 54.86,47.24 54.86,42.42 50.8,38.35 49.28,38.35 48.81,37.89 U$2.P$56
  Bottom 0.203: v57.4,49.78 59.69,52.07 61.72,52.07 62.23,52.58 62.23,54.61 JP12.8
LCD-CS  (via drill 0.51)
  Top 0.203: U$2.P$54 49.34,36.89 49.78,37.34 52.32,37.34 v54.86,39.88
  Bottom 0.203: U$20.5 54.21,39.22 v54.86,39.88
LCD-MOSI  (via drill 0.51)
  Top 0.203: U$2.P$57 48.55,38.39 49.02,38.86 50.29,38.86 v52.83,41.4
  Bottom 0.203: U$20.3 53.21,37.72 52.83,38.1 v52.83,41.4
LCD-RESET  (via drill 0.51)
  Top 0.203: U$2.P$59 50.06,39.39 52.07,41.4 v52.07,42.16
  Bottom 0.203: U$20.2 52.71,37.46 52.07,38.1 v52.07,42.16
LCD-SCK  (via drill 0.51)
  Top 0.203: U$2.P$55 49.07,37.39 49.53,37.85 51.31,37.85 v54.1,40.64
  Top 0.254: v58.42,44.96 JP12.3
  Bottom 0.203: U$20.4 53.71,40.25 v54.1,40.64 v58.42,44.96
LIPOP  (via drill 0.51)
  Top 0.203: U1.15 U1.14 | U1.16 U1.15 | U1.15 13.93,40.93 13.68,40.93 | R42.1 38.47,61.33 39.37,62.23
  Top 0.406: 13.68,40.93 13.21,41.4 v13.21,59.31 | JP2.2 95.44,60.77 93.98,62.23 39.37,62.23 v26.67,62.23
  Bottom 0.406: v13.21,59.31 13.21,61.47 13.97,62.23 v26.67,62.23
MP3-CS
  Top 0.203: U4.23 39.84,14.95 40.13,15.24 40.13,17.53 39.62,18.03 38.35,18.03 38.1,18.29 38.1,22.1 37.15,23.04 37.15,29.03 38.33,30.2 U$2.P$39
MP3-DCS  (via drill 0.51)
  Top 0.203: U4.13 36.11,9.95 v37.08,10.92 | v37.08,18.29 37.08,22.1 36.35,22.83 36.35,28.99 37.83,30.46 U$2.P$38
  Bottom 0.203: v37.08,10.92 v37.08,18.29
MP3-DREQ  (via drill 0.51)
  Top 0.203: U4.8 31.23,7.63 31.5,7.37 33.78,7.37 34.8,6.35 v35.56,6.35 | v35.55,22.1 v35.56,22.1 35.56,28.96 37.33,30.72 U$2.P$37
  Bottom 0.203: v35.56,6.35 v35.56,22.1
MP3-MISO
  Top 0.203: U4.30 30.73,22.6 32,23.88 33.78,23.88 33.95,24.05 33.95,28.87 36.33,31.25 U$2.P$35
MP3-MOSI
  Top 0.203: U4.29 31.23,22.34 32.26,23.37 34.29,23.37 34.75,23.83 34.75,28.91 36.83,30.98 U$2.P$36
MP3-RESET
  Top 0.203: U4.3 28.73,7.39 27.94,6.6 27.94,3.81 | 27.94,3.81 27.94,3.56 28.45,3.05 44.96,3.05 45.72,3.81 45.72,19.05 45.21,19.56 43.18,19.56 41.66,21.08 40.13,21.08 37.85,23.37 37.85,28.96 38.83,29.94 U$2.P$40 | R25.2 27.94,3.81
MP3-SCK  (via drill 0.51)
  Top 0.203: U4.28 31.73,21.57 32.26,22.1 v33.02,22.1 | U$2.P$34 35.83,31.51 33.02,28.7 v33.02,25.15
  Bottom 0.203: v33.02,22.1 v33.02,25.15
MP3GPIOGND1
  Top 0.203: U4.9 U4.10 U4.11 U4.12 34.34,8.45 R40.2
MP3GPIOGND2
  Top 0.203: U4.33 29.23,17.76 28.96,18.03 28.73,17.81 | 28.73,17.81 U4.34 | U4.36 27.73,17.82 | 27.73,17.82 27.94,18.03 28.5,18.03 28.73,17.81 | 27.73,17.82 26.76,17.82 R35.2
MP3GPIOGND3
  Top 0.203: U4.25 33.6,16.95 R34.2
N$1
  Top 0.203: U$2.P$60 46.86,39.89 R1.2
N$2
  Top 0.203: C4.2 52.42,53.73 Q3.P4 51.31,52.62 51.31,49.53 50.55,48.77 47.24,48.77 46.74,48.26 46.74,46.99 45.72,45.97 42.93,45.97 41.83,44.87 U$2.P$3
N$3
  Top 0.203: C3.2 42.03,52.77 Y1.1 41.65,51.81 41.43,51.81 40.33,50.71 U$2.P$6
N$4
  Top 0.203: U$2.P$5 40.83,45.4 42.42,46.99 43.18,46.99 43.95,47.76 Y1.3 43.95,48.76 C2.2
N$5
  Top 0.203: C5.2 46.99,53.84 Q3.P1 48.16,50.45 47.24,49.53 47.12,49.4 46.23,48.51 46.23,47.24 45.47,46.48 42.67,46.48 41.33,45.14 U$2.P$4
N$6
  Top 0.203: L1.P$2 77.75,51.84 76.71,50.8 73.91,50.8 73.66,51.05 U2.3
N$7
  Top 0.203: U2.1 72.66,51.58 72.25,51.17 C8.1
N$8
  Top 0.203: U4.18 37.98,12.45 R24.2 39.37,11.18 41.66,11.18 43.18,12.7 Q1.2 43.18,17.78 41.4,19.56 C24.2
N$9  (via drill 0.51)
  Top 0.254: Q2.3 51.73,23.03 v52.07,23.37
  Bottom 0.254: U$20.9 52.72,22.72 v52.07,23.37
N$10
  Top 0.203: U1.6 16.13,38.09 R3.1
N$11
  Top 0.203: U1.7 17.03,38.97 R4.1
N$12
  Top 0.203: U1.8 16.88,39.37 R8.1
N$13
  Top 0.203: LED3.C 19.56,40.25 R8.2
N$14
  Top 0.203: LED2.C 21.87,42.95 20.57,41.66 20.57,38.86 20.07,38.35 R4.2
N$15
  Top 0.203: R3.2 21.06,36.58 LED1.C
N$16
  Top 0.203: U1.5 15.53,36.91 R9.1
N$17
  Top 0.203: U1.4 15.13,35.3 R12.2 R13.1
N$18
  Top 0.203: U1.12 15.13,41.41 R10.1
N$19
  Top 0.203: U1.13 14.73,42.28 R11.1
N$20  (via drill 0.51)
  Top 0.203: R17.2 C13.1 28.31,29.09 29.46,27.94 29.46,27.43 29.72,27.18 v32,27.18 | U$2.P$45 41.33,27.76 v41.4,27.69
  Bottom 0.203: v32,27.18 40.89,27.18 v41.4,27.69
N$21
  Top 0.203: U1.17 12.55,39.77 12.45,39.88 12.45,41.29 R15.1 R14.2
N$22  (via drill 0.51)
  Top 0.203: v31.24,29.21 29.86,30.6 C12.1 R16.2 | U$2.P$44 40.83,28.89 v40.13,28.19
  Bottom 0.203: v31.24,29.21 39.12,29.21 v40.13,28.19
N$23
  Top 0.203: U4.17 37.58,11.95 38.1,11.43 38.1,10.53 R24.1 41.54,9.26 43.18,7.62 Q1.1 42.03,5.45 C26.2
N$24
  Top 0.203: U4.44 25.16,11.95 23.88,10.67 C27.2
N$25
  Top 0.203: S1.2 S1.1 32.26,50.67 R19.2
N$26
  Top 0.203: L2.P$1 57.15,16.77 R21.2 61.06,18.05 R20.2 61.59,17.52 U3.7
N$27
  Top 0.203: U3.8 59.35,15.32 R21.1
N$28
  Top 0.203: U3.5 65.22,15.32 R23.1 66.04,15.61 R22.2
N$29
  Top 0.203: U3.3 62.87,7.88 C18.1
N$30
  Top 0.203: U3.1 59.1,10.08 D1.2 57.91,9.4 57.15,10.16 L2.P$2
N$31
  Top 0.203: R29.1 C30.1
N$32
  Top 0.203: R28.1 C29.1
N$33
  Top 0.203: R27.1 C28.1
N$34
  Top 0.203: R36.1 89.41,44.87 U$28.5
N$35
  Top 0.203: U$28.13 82.9,15.57 LED5.A
N$36
  Top 0.203: U$28.6 86.9,47.74 LED4.A
N$37
  Top 0.203: LED4.C 88.86,50.78 R37.2
N$38
  Top 0.203: U$28.15 86.9,15.5 LED6.A
N$39
  Top 0.203: R39.2 LED5.C
N$40
  Top 0.203: R41.2 LED6.C
NOK-LEDCTL  (via drill 0.51)
  Top 0.203: v55.37,37.34 54.86,36.83 50.04,36.83 48.6,35.39 U$2.P$51 | Q2.1 50.48,30.41 51.56,31.5 v55.37,31.5
  Bottom 0.203: v55.37,31.5 v55.37,37.34
NOK-VLED  (via drill 0.51)
  Top 0.203: R23.2 C19.1 67.58,5.34 65.28,3.05 61.98,3.05 60.83,4.19 C20.A 60.45,5.08 D1.1 50.45,7.11 | JP8.1 50.45,7.11 | 50.45,7.11 50.05,7.11 49.53,7.62 v49.53,19.05
  Bottom 0.203: JP8.1 49.68,6.34 | U$20.10 49.68,19.2 v49.53,19.05
SD-CS  (via drill 0.51)
  Top 0.203: v24.38,54.1 26.42,52.07 26.42,42.42 27.94,40.89 28.7,40.89 29.21,40.39 U$2.P$20 | U5.2 17.08,54.29 v17.27,54.1
  Bottom 0.203: v24.38,54.1 v17.27,54.1
SD-MISO
  Top 0.203: U5.7 22.58,52.6 23.37,51.82 25.15,51.82 25.4,51.56 25.4,41.91 27.43,39.88 28.19,39.88 28.68,39.39 U$2.P$22
SD-MOSI
  Top 0.203: U5.3 18.18,52.68 19.56,51.31 23.88,51.31 24.89,50.29 24.89,41.66 27.18,39.37 27.94,39.37 28.42,38.89 U$2.P$23
SD-SCK  (via drill 0.51)
  Top 0.203: v23.62,52.83 23.88,52.58 25.15,52.58 25.91,51.82 25.91,42.16 27.69,40.39 28.45,40.39 28.94,39.89 U$2.P$21 | U5.5 20.38,54.04 v21.59,52.83
  Bottom 0.203: v23.62,52.83 v21.59,52.83
USB-DETECT  (via drill 0.51)
  Top 0.203: R45.2 R44.1 11.82,55.51 12.19,55.88 12.19,60.45 15.24,63.5 36.83,63.5 v37.08,63.25 | U$2.P$10 38.33,47.22 v38.1,47.5
  Bottom 0.203: 37.85,62.48 v37.08,63.25 38.1,62.23 v38.1,47.5
USBDM  (via drill 0.51)
  Top 0.203: X1.D- 4.46,52.72 3.81,52.07 3.81,50.55 4.83,49.53 5.84,49.53 6.35,49.02 6.35,43.18 3.05,39.88 v3.05,38.61 3.89,37.77 J1.25 | R16.1 24.78,32.4 21.59,29.21 8.64,29.21 v8.38,29.46
  Bottom 0.203: v3.05,38.61 3.05,30.48 4.06,29.46 v8.38,29.46
USBDP  (via drill 0.51)
  Top 0.203: J1.27 8.29,38.77 8.64,39.12 v8.64,41.66 8.64,51.31 7.87,52.07 X1.D+ | R17.1 23,27.29 21.59,28.7 9.65,28.7 v9.14,28.19
  Bottom 0.203: v9.14,28.19 9.14,41.15 v8.64,41.66
UVLO
  Top 0.203: U2.7 74.16,56.75 R7.2 R5.1 C7.2
VBATT  (via drill 0.51)
  Top 0.203: 13.33,37.97 U1.20 | 13.33,37.97 U1.1 | 17.78,24.64 17.92,24.78 U$7.3 19.99,26.16 26.92,26.16 27.94,25.15 27.94,24.64 | U$7.1 17.92,23.48 17.78,23.62 17.78,24.64 | U$12.1 28.08,23.48 27.94,23.62 27.94,24.64 | 27.94,24.64 28.08,24.78 U$12.3 30.62,24.78 31.24,25.4 v31.24,25.91 | U3.6 62.87,17.52 R20.1 62.99,17.92 62.99,19.56 62.48,20.07 57.15,20.07 | U2.5 77.01,51.87 77.22,52.07 77.22,54.61 | U2.6 77.01,54.81 77.22,54.61 | L1.P$1 77.45,54.84 77.22,54.61 | L1.P$1 78.74,56.78 R5.2 C7.1 78.37,59.81 77.98,60.2 75.44,60.2 | U2.8 73.66,58.42 75.44,60.2 | 13.33,37.97 13.33,35.82 C10.1 10.55,34.68 9.91,34.04 v9.91,31.5 | 17.78,24.64 17.78,25.4 17.02,26.16 11.18,26.16 v9.91,27.43 | v38.86,25.91 38.86,23.11 40.39,21.59 41.91,21.59 43.43,20.07 57.15,20.07 | 69.34,60.2 55.37,60.2 53.85,58.67 53.85,49.02 53.09,48.26 53.09,46.23 52.07,45.21 43.43,45.21 42.83,44.6 U$2.P$1 | 69.34,60.2 75.44,60.2 | 57.15,20.07 57.15,23.88 v64.52,31.24 | v64.52,35.05 64.52,42.16 v68.07,45.72 | v68.07,48.26 68.07,58.93 69.34,60.2 | L1.P$1 79.78,54.84 80.52,54.1 80.52,51.56 81.28,50.8 82.55,50.8 83.7,49.65 C43.A
  Bottom 0.203: v9.91,27.43 v9.91,31.5 | v31.24,25.91 v38.86,25.91 | v64.52,31.24 v64.52,35.05 | v68.07,45.72 v68.07,48.26
WIFI-CTS  (via drill 0.51)
  Top 0.203: U$28.12 80.4,22.86 R38.1 75.83,31.87 75.18,32.51 50.29,32.51 50.04,32.26 v49.02,32.26 | U$2.P$14 36.33,45.46 v36.07,45.72
  Bottom 0.203: v49.02,32.26 36.07,45.21 v36.07,45.72
WIFI-RTS  (via drill 0.51)
  Top 0.203: U$28.16 88.9,31.75 87.63,33.02 v49.78,33.02 | U$2.P$15 35.83,44.95 v34.8,45.97
  Bottom 0.203: v49.78,33.02 49.02,33.02 37.08,44.96 37.08,45.97 36.32,46.74 35.56,46.74 v34.8,45.97
WIFI-RX  (via drill 0.51)
  Top 0.203: U$28.2 94.9,34.19 94.23,33.53 50.8,33.53 v50.55,33.78 | v37.85,41.4 v41.91,41.4 | U$2.P$17 35.03,41.89 v35.05,41.91
  Bottom 0.203: v50.55,33.78 49.02,33.78 41.91,40.89 v41.91,41.4 | v37.85,41.4 35.56,41.4 v35.05,41.91
WIFI-TX  (via drill 0.51)
  Top 0.203: U$28.3 92.9,35.75 91.19,34.04 51.82,34.04 v51.31,34.54 | U$2.P$16 35.33,44.43 34.8,44.96 v34.04,44.96
  Bottom 0.203: v51.31,34.54 49.02,34.54 42.93,40.64 42.93,41.66 37.34,47.24 34.8,47.24 33.78,46.23 33.78,45.21 v34.04,44.96

### Text on the board
tPlace: GND | 3.3V | RST | TRST | GND | TCK | SCK | TMS | TDI | EN | USBH | 1.8V | 2.8V | 3.3V | GND | WiFi MP3 | NOK-VLED | 2011-11-08